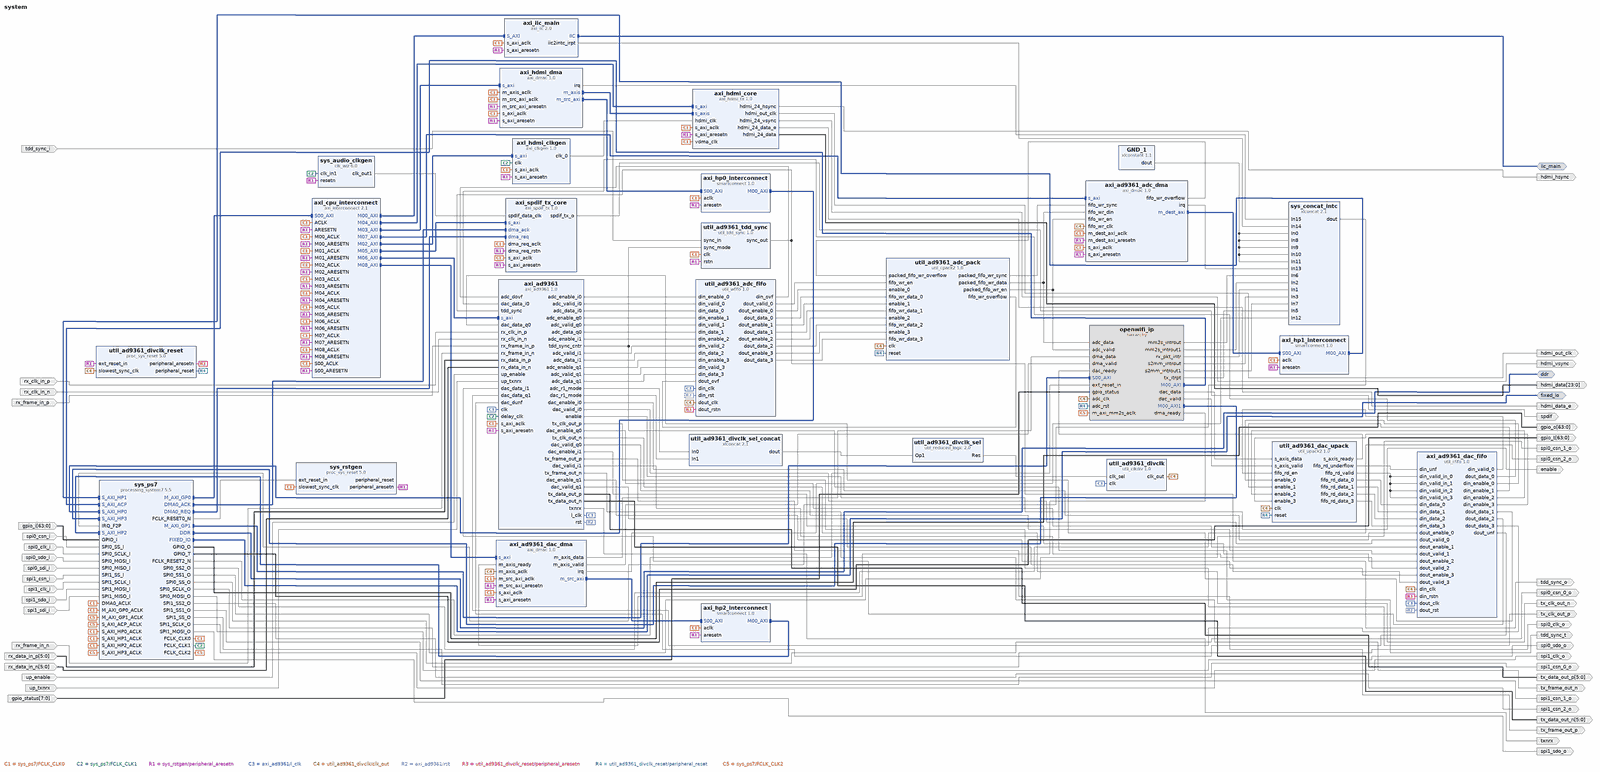
[diagram p0: block diagram of the top level, whole]
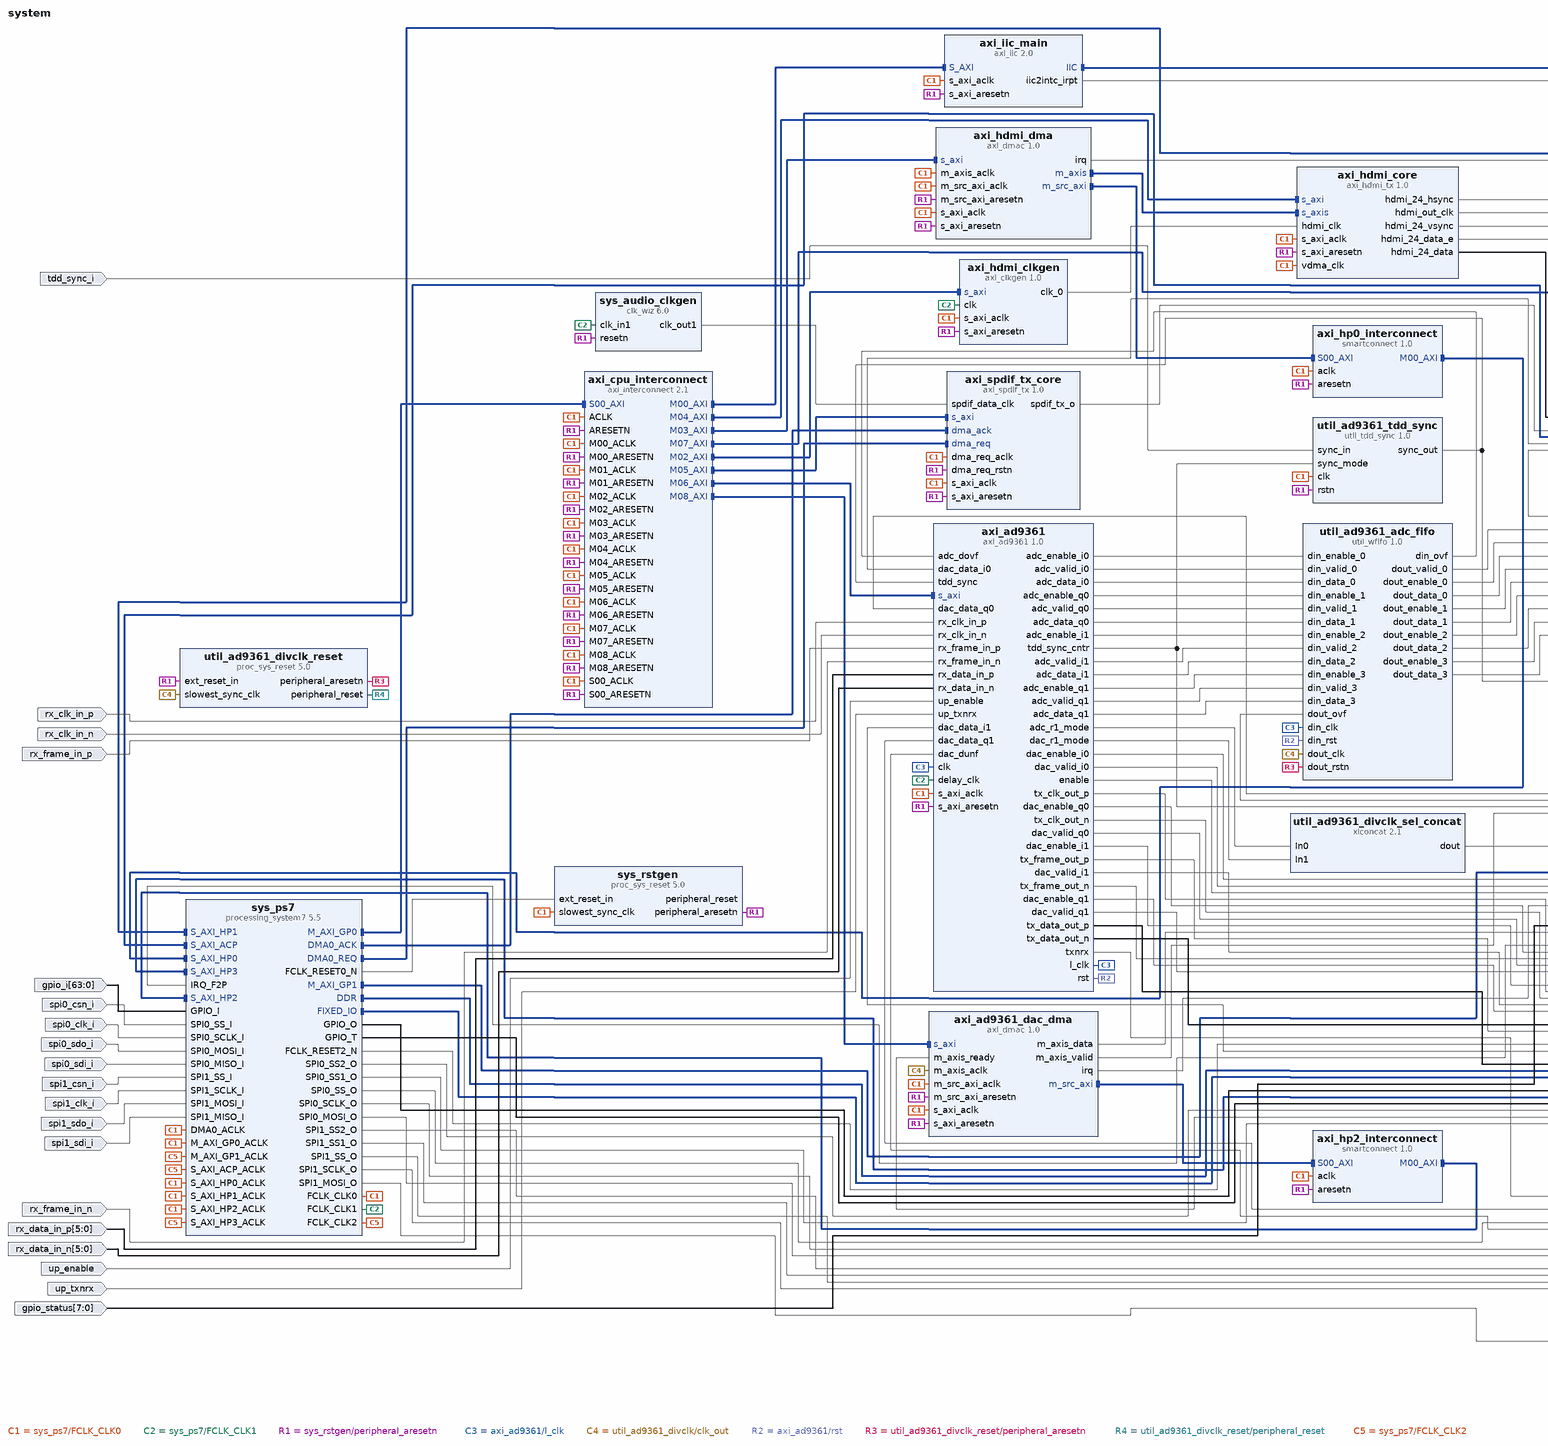
[diagram p1: block diagram of the top level, left part]
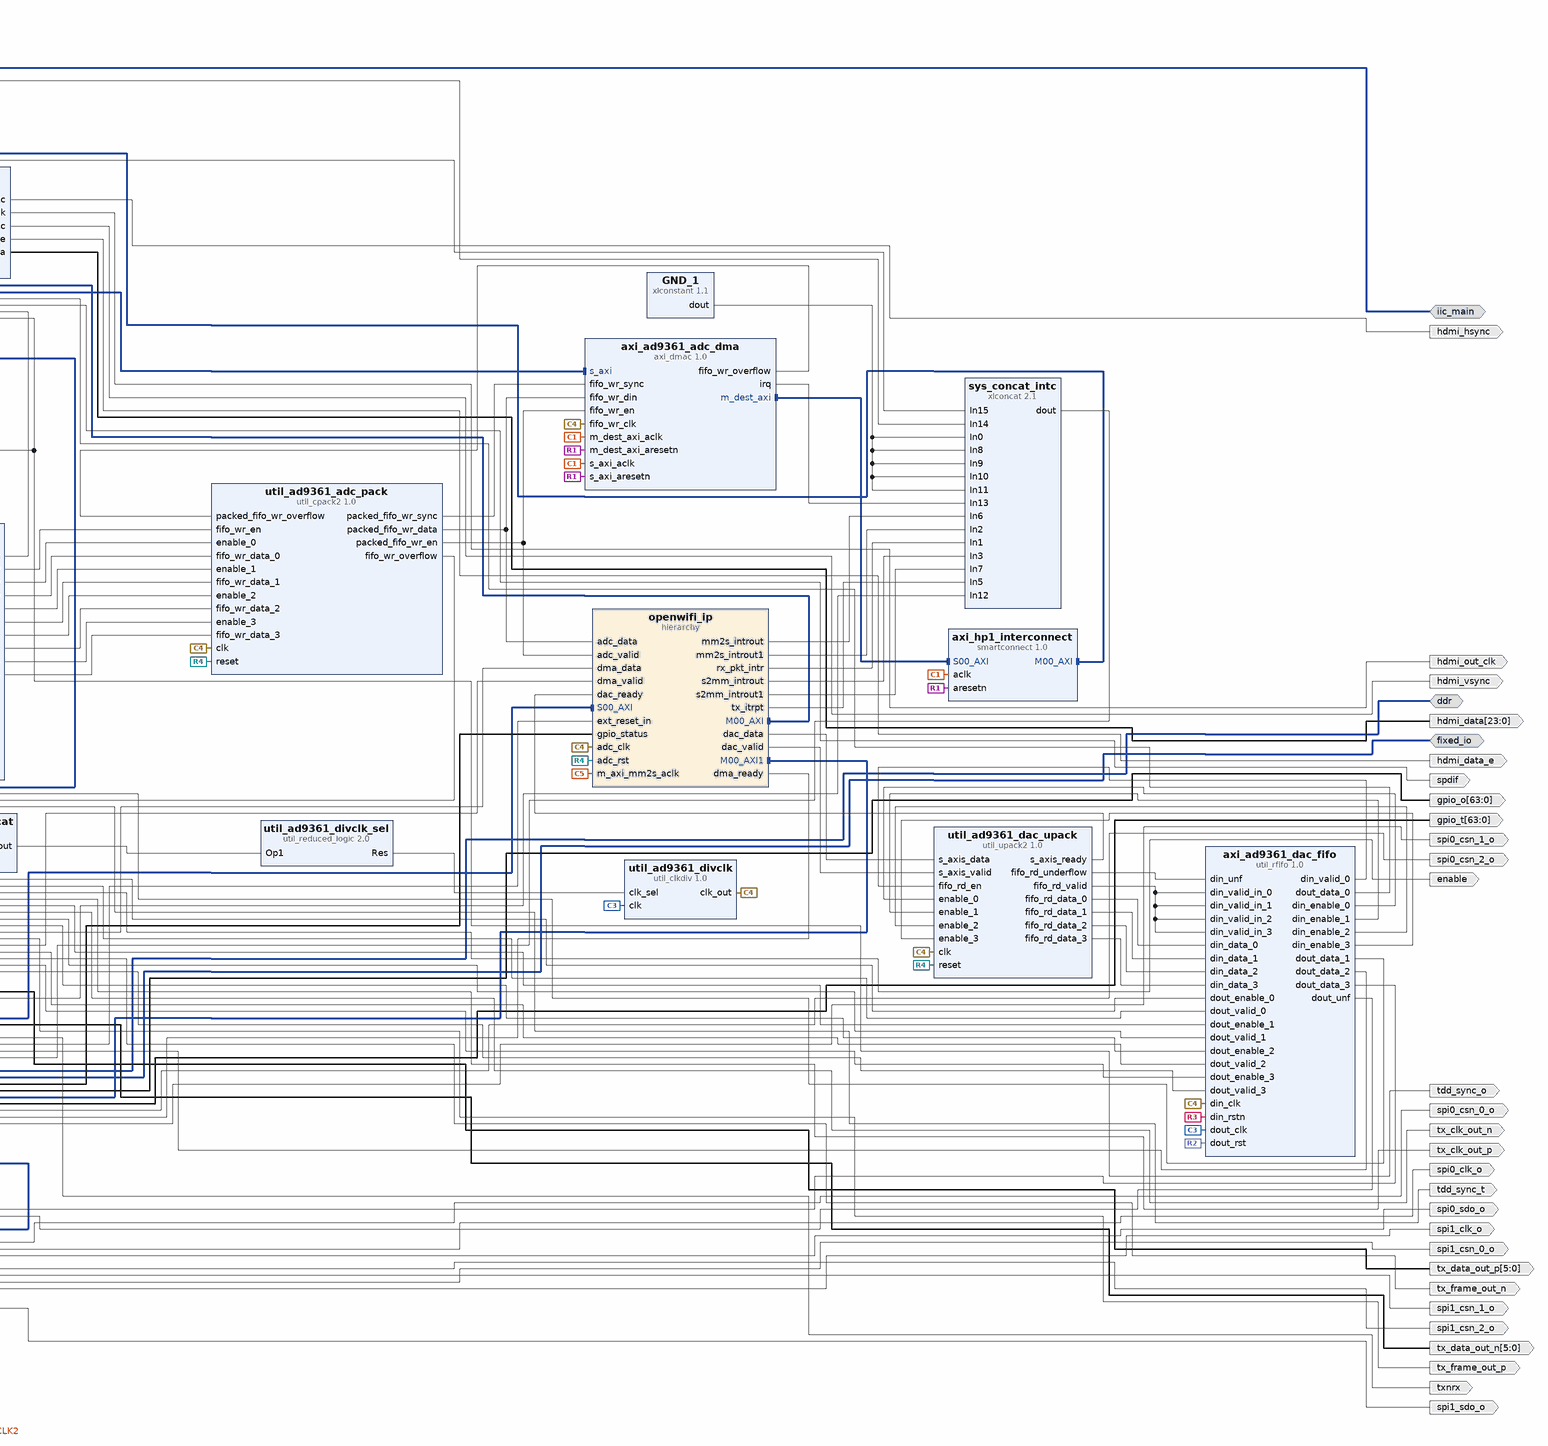
[diagram p2: block diagram of the top level, right part]
# Vivado block design system, xc7z045ffg900-2, Vivado 2018.3
create_bd_design system

create_bd_intf_port -mode Master -vlnv xilinx.com:interface:ddrx_rtl:1.0 ddr
create_bd_intf_port -mode Master -vlnv xilinx.com:interface:iic_rtl:1.0 iic_main
create_bd_intf_port -mode Master -vlnv xilinx.com:display_processing_system7:fixedio_rtl:1.0 fixed_io
create_bd_port -dir O spi0_csn_2_o
create_bd_port -dir O spi0_csn_1_o
create_bd_port -dir O spi0_csn_0_o
create_bd_port -dir I spi0_csn_i
create_bd_port -dir I spi0_clk_i
create_bd_port -dir O spi0_clk_o
create_bd_port -dir I spi0_sdo_i
create_bd_port -dir O spi0_sdo_o
create_bd_port -dir I spi0_sdi_i
create_bd_port -dir O spi1_csn_2_o
create_bd_port -dir O spi1_csn_1_o
create_bd_port -dir O spi1_csn_0_o
create_bd_port -dir I spi1_csn_i
create_bd_port -dir I spi1_clk_i
create_bd_port -dir O spi1_clk_o
create_bd_port -dir I spi1_sdo_i
create_bd_port -dir O spi1_sdo_o
create_bd_port -dir I spi1_sdi_i
create_bd_port -dir I -from 63 -to 0 gpio_i
create_bd_port -dir O -from 63 -to 0 gpio_o
create_bd_port -dir O -from 63 -to 0 gpio_t
create_bd_port -dir O hdmi_out_clk
create_bd_port -dir O hdmi_hsync
create_bd_port -dir O hdmi_vsync
create_bd_port -dir O hdmi_data_e
create_bd_port -dir O -from 23 -to 0 hdmi_data
create_bd_port -dir O spdif
create_bd_port -dir I rx_clk_in_p
create_bd_port -dir I rx_clk_in_n
create_bd_port -dir I rx_frame_in_p
create_bd_port -dir I rx_frame_in_n
create_bd_port -dir I -from 5 -to 0 rx_data_in_p
create_bd_port -dir I -from 5 -to 0 rx_data_in_n
create_bd_port -dir O tx_clk_out_p
create_bd_port -dir O tx_clk_out_n
create_bd_port -dir O tx_frame_out_p
create_bd_port -dir O tx_frame_out_n
create_bd_port -dir O -from 5 -to 0 tx_data_out_p
create_bd_port -dir O -from 5 -to 0 tx_data_out_n
create_bd_port -dir O enable
create_bd_port -dir O txnrx
create_bd_port -dir I up_enable
create_bd_port -dir I up_txnrx
create_bd_port -dir O tdd_sync_o
create_bd_port -dir I tdd_sync_i
create_bd_port -dir O tdd_sync_t
create_bd_port -dir I -from 7 -to 0 gpio_status

create_bd_cell -type ip -vlnv xilinx.com:ip:processing_system7:5.5 sys_ps7
set_property -dict [list \
  CONFIG.PCW_APU_PERIPHERAL_FREQMHZ 667.000000 \
  CONFIG.PCW_DUAL_PARALLEL_QSPI_DATA_MODE x8 \
  CONFIG.PCW_ENET0_ENET0_IO {MIO 16 .. 27} \
  CONFIG.PCW_ENET0_GRP_MDIO_ENABLE 1 \
  CONFIG.PCW_ENET0_GRP_MDIO_IO {MIO 52 .. 53} \
  CONFIG.PCW_ENET0_PERIPHERAL_ENABLE 1 \
  CONFIG.PCW_ENET0_PERIPHERAL_FREQMHZ {100 Mbps} \
  CONFIG.PCW_ENET0_RESET_ENABLE 1 \
  CONFIG.PCW_ENET0_RESET_IO {MIO 47} \
  CONFIG.PCW_ENET_RESET_ENABLE 1 \
  CONFIG.PCW_ENET_RESET_SELECT {Share reset pin} \
  CONFIG.PCW_EN_CLK1_PORT 1 \
  CONFIG.PCW_EN_CLK2_PORT 1 \
  CONFIG.PCW_EN_RST1_PORT 1 \
  CONFIG.PCW_EN_RST2_PORT 1 \
  CONFIG.PCW_FCLK_CLK1_BUF TRUE \
  CONFIG.PCW_FCLK_CLK2_BUF TRUE \
  CONFIG.PCW_FPGA0_PERIPHERAL_FREQMHZ 100.0 \
  CONFIG.PCW_FPGA1_PERIPHERAL_FREQMHZ 200.0 \
  CONFIG.PCW_FPGA2_PERIPHERAL_FREQMHZ 200 \
  CONFIG.PCW_FPGA_FCLK1_ENABLE 1 \
  CONFIG.PCW_FPGA_FCLK2_ENABLE 1 \
  CONFIG.PCW_GPIO_EMIO_GPIO_ENABLE 1 \
  CONFIG.PCW_GPIO_EMIO_GPIO_IO 64 \
  CONFIG.PCW_GPIO_MIO_GPIO_ENABLE 1 \
  CONFIG.PCW_GPIO_MIO_GPIO_IO MIO \
  CONFIG.PCW_I2C0_GRP_INT_ENABLE 0 \
  CONFIG.PCW_I2C0_I2C0_IO {MIO 50 .. 51} \
  CONFIG.PCW_I2C0_PERIPHERAL_ENABLE 1 \
  CONFIG.PCW_I2C0_RESET_ENABLE 1 \
  CONFIG.PCW_I2C0_RESET_IO {MIO 46} \
  CONFIG.PCW_I2C_PERIPHERAL_FREQMHZ 111.111115 \
  CONFIG.PCW_I2C_RESET_ENABLE 1 \
  CONFIG.PCW_I2C_RESET_SELECT {Share reset pin} \
  CONFIG.PCW_IRQ_F2P_INTR 1 \
  CONFIG.PCW_IRQ_F2P_MODE REVERSE \
  CONFIG.PCW_PRESET_BANK0_VOLTAGE {LVCMOS 1.8V} \
  CONFIG.PCW_PRESET_BANK1_VOLTAGE {LVCMOS 1.8V} \
  CONFIG.PCW_QSPI_GRP_FBCLK_ENABLE 1 \
  CONFIG.PCW_QSPI_GRP_FBCLK_IO {MIO 8} \
  CONFIG.PCW_QSPI_GRP_IO1_ENABLE 1 \
  CONFIG.PCW_QSPI_GRP_IO1_IO {MIO 0 9 .. 13} \
  CONFIG.PCW_QSPI_GRP_SINGLE_SS_ENABLE 0 \
  CONFIG.PCW_QSPI_INTERNAL_HIGHADDRESS 0xFDFFFFFF \
  CONFIG.PCW_QSPI_PERIPHERAL_ENABLE 1 \
  CONFIG.PCW_QSPI_QSPI_IO {MIO 1 .. 6} \
  CONFIG.PCW_SD0_GRP_CD_ENABLE 1 \
  CONFIG.PCW_SD0_GRP_CD_IO {MIO 14} \
  CONFIG.PCW_SD0_GRP_WP_ENABLE 1 \
  CONFIG.PCW_SD0_GRP_WP_IO {MIO 15} \
  CONFIG.PCW_SD0_PERIPHERAL_ENABLE 1 \
  CONFIG.PCW_SD0_SD0_IO {MIO 40 .. 45} \
  CONFIG.PCW_SDIO_PERIPHERAL_FREQMHZ 50 \
  CONFIG.PCW_SPI0_PERIPHERAL_ENABLE 1 \
  CONFIG.PCW_SPI0_SPI0_IO EMIO \
  CONFIG.PCW_SPI1_PERIPHERAL_ENABLE 1 \
  CONFIG.PCW_SPI1_SPI1_IO EMIO \
  CONFIG.PCW_UART1_PERIPHERAL_ENABLE 1 \
  CONFIG.PCW_UART1_UART1_IO {MIO 48 .. 49} \
  CONFIG.PCW_UART_PERIPHERAL_FREQMHZ 50 \
  CONFIG.PCW_UIPARAM_DDR_FREQ_MHZ 533.333313 \
  CONFIG.PCW_UIPARAM_DDR_PARTNO Custom \
  CONFIG.PCW_USB0_PERIPHERAL_ENABLE 1 \
  CONFIG.PCW_USB0_RESET_ENABLE 1 \
  CONFIG.PCW_USB0_RESET_IO {MIO 7} \
  CONFIG.PCW_USB0_USB0_IO {MIO 28 .. 39} \
  CONFIG.PCW_USB_RESET_ENABLE 1 \
  CONFIG.PCW_USB_RESET_SELECT {Share reset pin} \
  CONFIG.PCW_USE_DEFAULT_ACP_USER_VAL 1 \
  CONFIG.PCW_USE_DMA0 1 \
  CONFIG.PCW_USE_FABRIC_INTERRUPT 1 \
  CONFIG.PCW_USE_M_AXI_GP1 1 \
  CONFIG.PCW_USE_S_AXI_ACP 1 \
  CONFIG.PCW_USE_S_AXI_HP0 1 \
  CONFIG.PCW_USE_S_AXI_HP1 1 \
  CONFIG.PCW_USE_S_AXI_HP2 1 \
  CONFIG.PCW_USE_S_AXI_HP3 1 \
  CONFIG.preset ZC706 \
] [get_bd_cells sys_ps7]
# 242 more settings of sys_ps7 are not shown: defaults, MIO pin electricals, DDR timing, and values the tool derives
create_bd_cell -type ip -vlnv xilinx.com:ip:axi_iic:2.0 axi_iic_main
set_property -dict {CONFIG.IIC_BOARD_INTERFACE Custom CONFIG.USE_BOARD_FLOW true} [get_bd_cells axi_iic_main]
create_bd_cell -type ip -vlnv xilinx.com:ip:xlconcat:2.1 sys_concat_intc
set_property -dict {CONFIG.NUM_PORTS 16} [get_bd_cells sys_concat_intc]
create_bd_cell -type ip -vlnv xilinx.com:ip:proc_sys_reset:5.0 sys_rstgen
set_property -dict {CONFIG.C_EXT_RST_WIDTH 1} [get_bd_cells sys_rstgen]
create_bd_cell -type ip -vlnv analog.com:user:axi_clkgen:1.0 axi_hdmi_clkgen
create_bd_cell -type ip -vlnv analog.com:user:axi_hdmi_tx:1.0 axi_hdmi_core
set_property -dict {CONFIG.INTERFACE 24_BIT} [get_bd_cells axi_hdmi_core]
create_bd_cell -type ip -vlnv analog.com:user:axi_dmac:1.0 axi_hdmi_dma
set_property -dict [list \
  CONFIG.AXI_SLICE_DEST false \
  CONFIG.AXI_SLICE_SRC false \
  CONFIG.CYCLIC true \
  CONFIG.DMA_2D_TRANSFER true \
  CONFIG.DMA_DATA_WIDTH_SRC 64 \
  CONFIG.DMA_TYPE_DEST 1 \
  CONFIG.DMA_TYPE_SRC 0 \
] [get_bd_cells axi_hdmi_dma]
create_bd_cell -type ip -vlnv xilinx.com:ip:clk_wiz:6.0 sys_audio_clkgen
set_property -dict [list \
  CONFIG.CLKOUT1_REQUESTED_OUT_FREQ 12.288 \
  CONFIG.PRIM_SOURCE No_buffer \
  CONFIG.RESET_TYPE ACTIVE_LOW \
  CONFIG.USE_LOCKED false \
  CONFIG.USE_PHASE_ALIGNMENT false \
  CONFIG.USE_RESET true \
] [get_bd_cells sys_audio_clkgen]
create_bd_cell -type ip -vlnv analog.com:user:axi_spdif_tx:1.0 axi_spdif_tx_core
set_property -dict {CONFIG.DMA_TYPE 1 CONFIG.S_AXI_ADDRESS_WIDTH 16} [get_bd_cells axi_spdif_tx_core]
create_bd_cell -type ip -vlnv xilinx.com:ip:xlconstant:1.1 GND_1
set_property -dict {CONFIG.CONST_VAL 0 CONFIG.CONST_WIDTH 1} [get_bd_cells GND_1]
create_bd_cell -type ip -vlnv xilinx.com:ip:axi_interconnect:2.1 axi_cpu_interconnect
set_property -dict {CONFIG.NUM_MI 9} [get_bd_cells axi_cpu_interconnect]
create_bd_cell -type ip -vlnv xilinx.com:ip:smartconnect:1.0 axi_hp0_interconnect
set_property -dict {CONFIG.NUM_MI 1 CONFIG.NUM_SI 1} [get_bd_cells axi_hp0_interconnect]
create_bd_cell -type ip -vlnv analog.com:user:axi_ad9361:1.0 axi_ad9361
set_property -dict [list \
  CONFIG.ADC_INIT_DELAY 20 \
  CONFIG.DAC_DDS_CORDIC_DW 14 \
  CONFIG.DAC_DDS_TYPE 1 \
  CONFIG.ID 0 \
] [get_bd_cells axi_ad9361]
create_bd_cell -type ip -vlnv analog.com:user:util_tdd_sync:1.0 util_ad9361_tdd_sync
set_property -dict {CONFIG.TDD_SYNC_PERIOD 10000000} [get_bd_cells util_ad9361_tdd_sync]
create_bd_cell -type ip -vlnv xilinx.com:ip:xlconcat:2.1 util_ad9361_divclk_sel_concat
set_property -dict {CONFIG.NUM_PORTS 2} [get_bd_cells util_ad9361_divclk_sel_concat]
create_bd_cell -type ip -vlnv xilinx.com:ip:util_reduced_logic:2.0 util_ad9361_divclk_sel
set_property -dict {CONFIG.C_SIZE 2} [get_bd_cells util_ad9361_divclk_sel]
create_bd_cell -type ip -vlnv analog.com:user:util_clkdiv:1.0 util_ad9361_divclk
create_bd_cell -type ip -vlnv xilinx.com:ip:proc_sys_reset:5.0 util_ad9361_divclk_reset
create_bd_cell -type ip -vlnv analog.com:user:util_wfifo:1.0 util_ad9361_adc_fifo
set_property -dict [list \
  CONFIG.DIN_ADDRESS_WIDTH 4 \
  CONFIG.DIN_DATA_WIDTH 16 \
  CONFIG.DOUT_DATA_WIDTH 16 \
  CONFIG.NUM_OF_CHANNELS 4 \
] [get_bd_cells util_ad9361_adc_fifo]
create_bd_cell -type ip -vlnv analog.com:user:util_cpack2:1.0 util_ad9361_adc_pack
set_property -dict {CONFIG.NUM_OF_CHANNELS 4 CONFIG.SAMPLE_DATA_WIDTH 16} [get_bd_cells util_ad9361_adc_pack]
create_bd_cell -type ip -vlnv analog.com:user:axi_dmac:1.0 axi_ad9361_adc_dma
set_property -dict [list \
  CONFIG.AXI_SLICE_DEST false \
  CONFIG.AXI_SLICE_SRC false \
  CONFIG.CYCLIC false \
  CONFIG.DMA_2D_TRANSFER false \
  CONFIG.DMA_DATA_WIDTH_SRC 64 \
  CONFIG.DMA_TYPE_DEST 0 \
  CONFIG.DMA_TYPE_SRC 2 \
  CONFIG.SYNC_TRANSFER_START true \
] [get_bd_cells axi_ad9361_adc_dma]
create_bd_cell -type ip -vlnv analog.com:user:util_rfifo:1.0 axi_ad9361_dac_fifo
set_property -dict [list \
  CONFIG.DIN_ADDRESS_WIDTH 4 \
  CONFIG.DIN_DATA_WIDTH 16 \
  CONFIG.DOUT_DATA_WIDTH 16 \
] [get_bd_cells axi_ad9361_dac_fifo]
create_bd_cell -type ip -vlnv analog.com:user:util_upack2:1.0 util_ad9361_dac_upack
set_property -dict {CONFIG.NUM_OF_CHANNELS 4 CONFIG.SAMPLE_DATA_WIDTH 16} [get_bd_cells util_ad9361_dac_upack]
create_bd_cell -type ip -vlnv analog.com:user:axi_dmac:1.0 axi_ad9361_dac_dma
set_property -dict [list \
  CONFIG.AXI_SLICE_DEST false \
  CONFIG.AXI_SLICE_SRC false \
  CONFIG.CYCLIC true \
  CONFIG.DMA_2D_TRANSFER false \
  CONFIG.DMA_DATA_WIDTH_DEST 64 \
  CONFIG.DMA_TYPE_DEST 1 \
  CONFIG.DMA_TYPE_SRC 0 \
] [get_bd_cells axi_ad9361_dac_dma]
create_bd_cell -type ip -vlnv xilinx.com:ip:smartconnect:1.0 axi_hp1_interconnect
set_property -dict {CONFIG.NUM_MI 1 CONFIG.NUM_SI 1} [get_bd_cells axi_hp1_interconnect]
create_bd_cell -type ip -vlnv xilinx.com:ip:smartconnect:1.0 axi_hp2_interconnect
set_property -dict {CONFIG.NUM_MI 1 CONFIG.NUM_SI 1} [get_bd_cells axi_hp2_interconnect]
create_bd_cell -type hier openwifi_ip

# ---- hierarchy /openwifi_ip ----
current_bd_instance /openwifi_ip
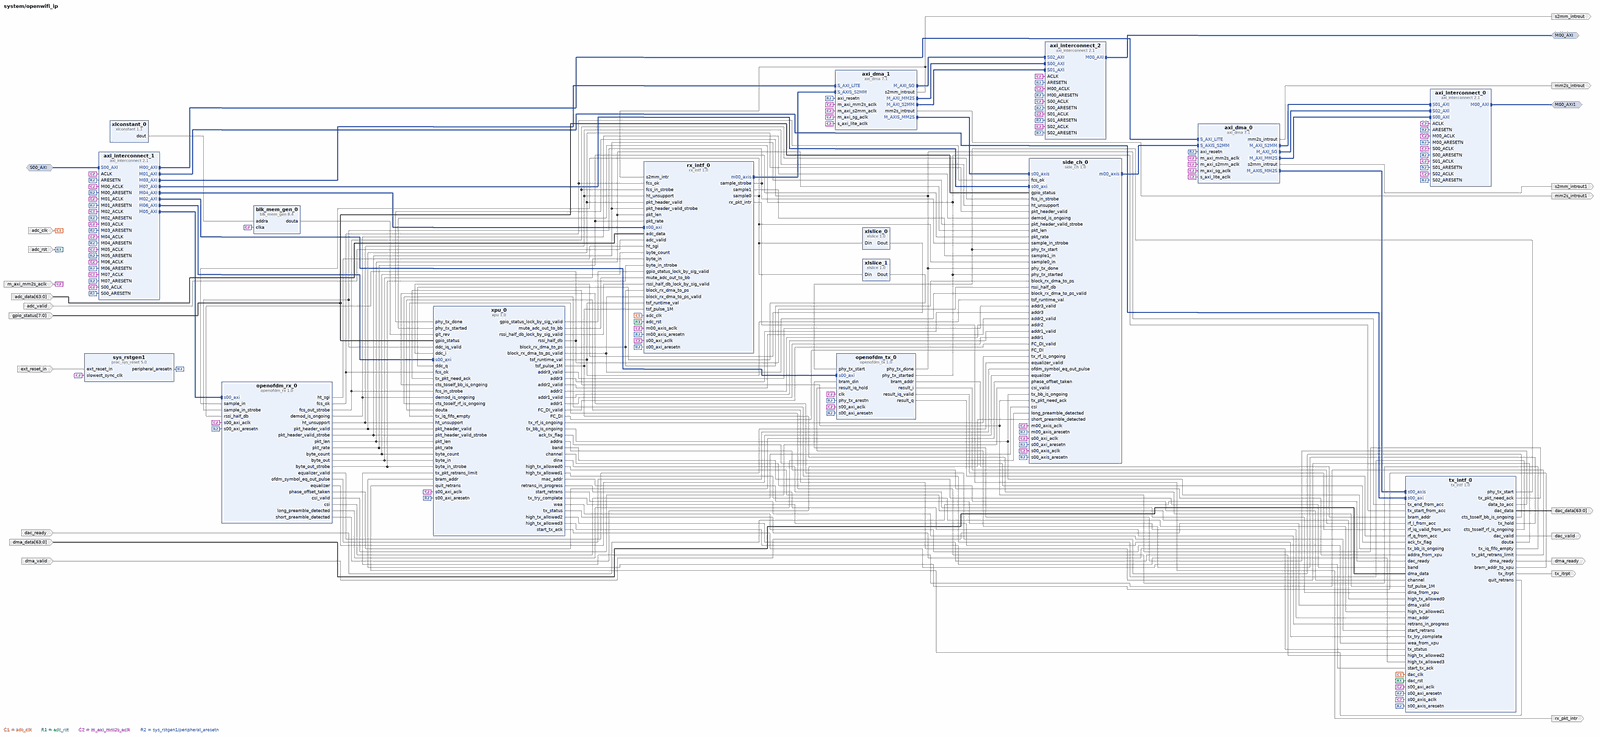
[diagram p3: block diagram inside /openwifi_ip, whole]
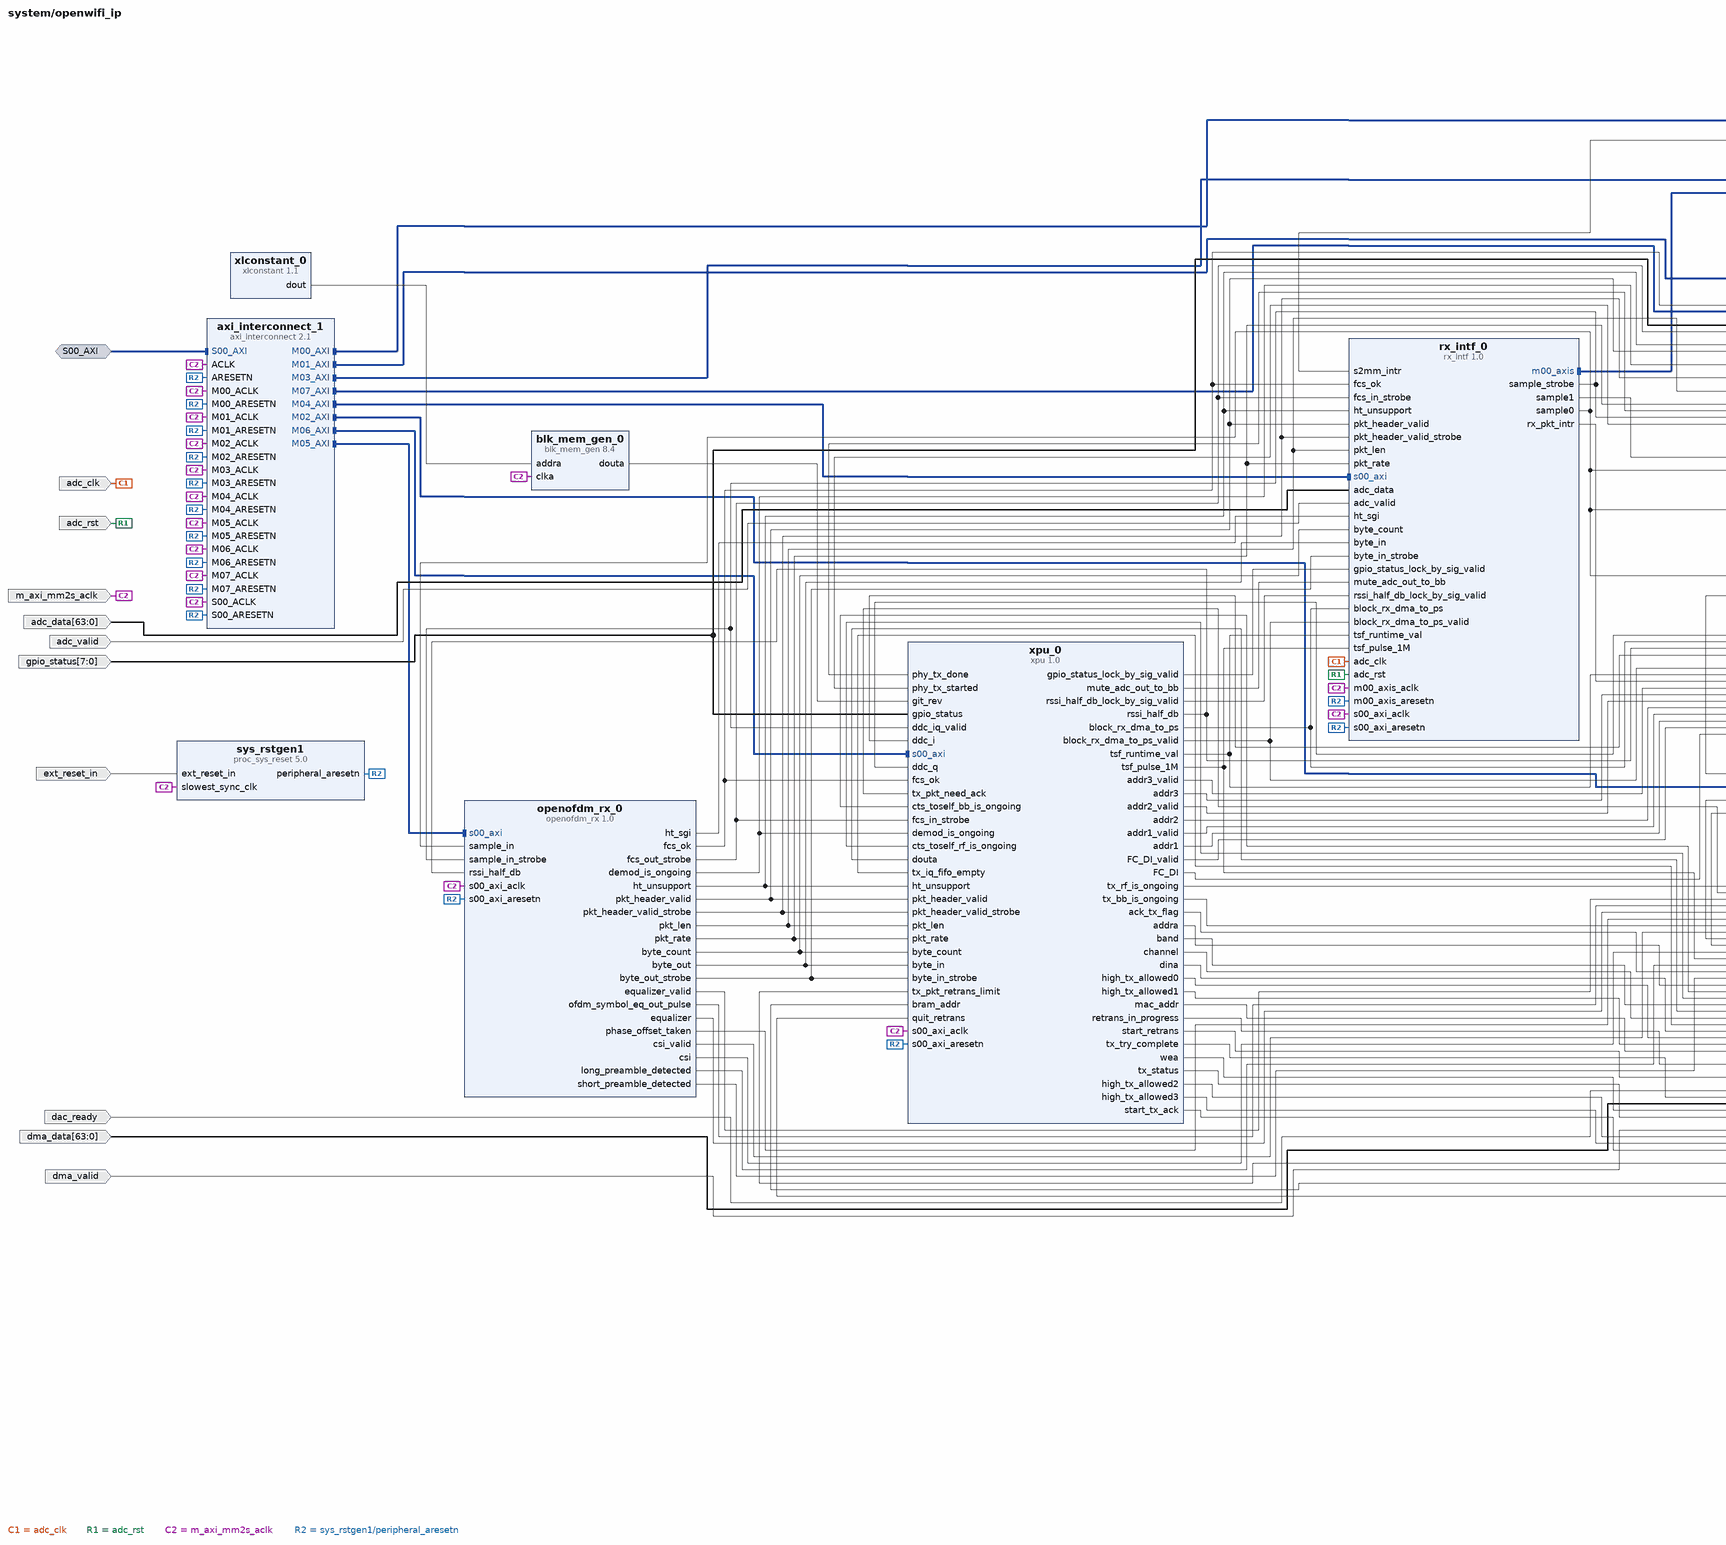
[diagram p4: block diagram inside /openwifi_ip, left part]
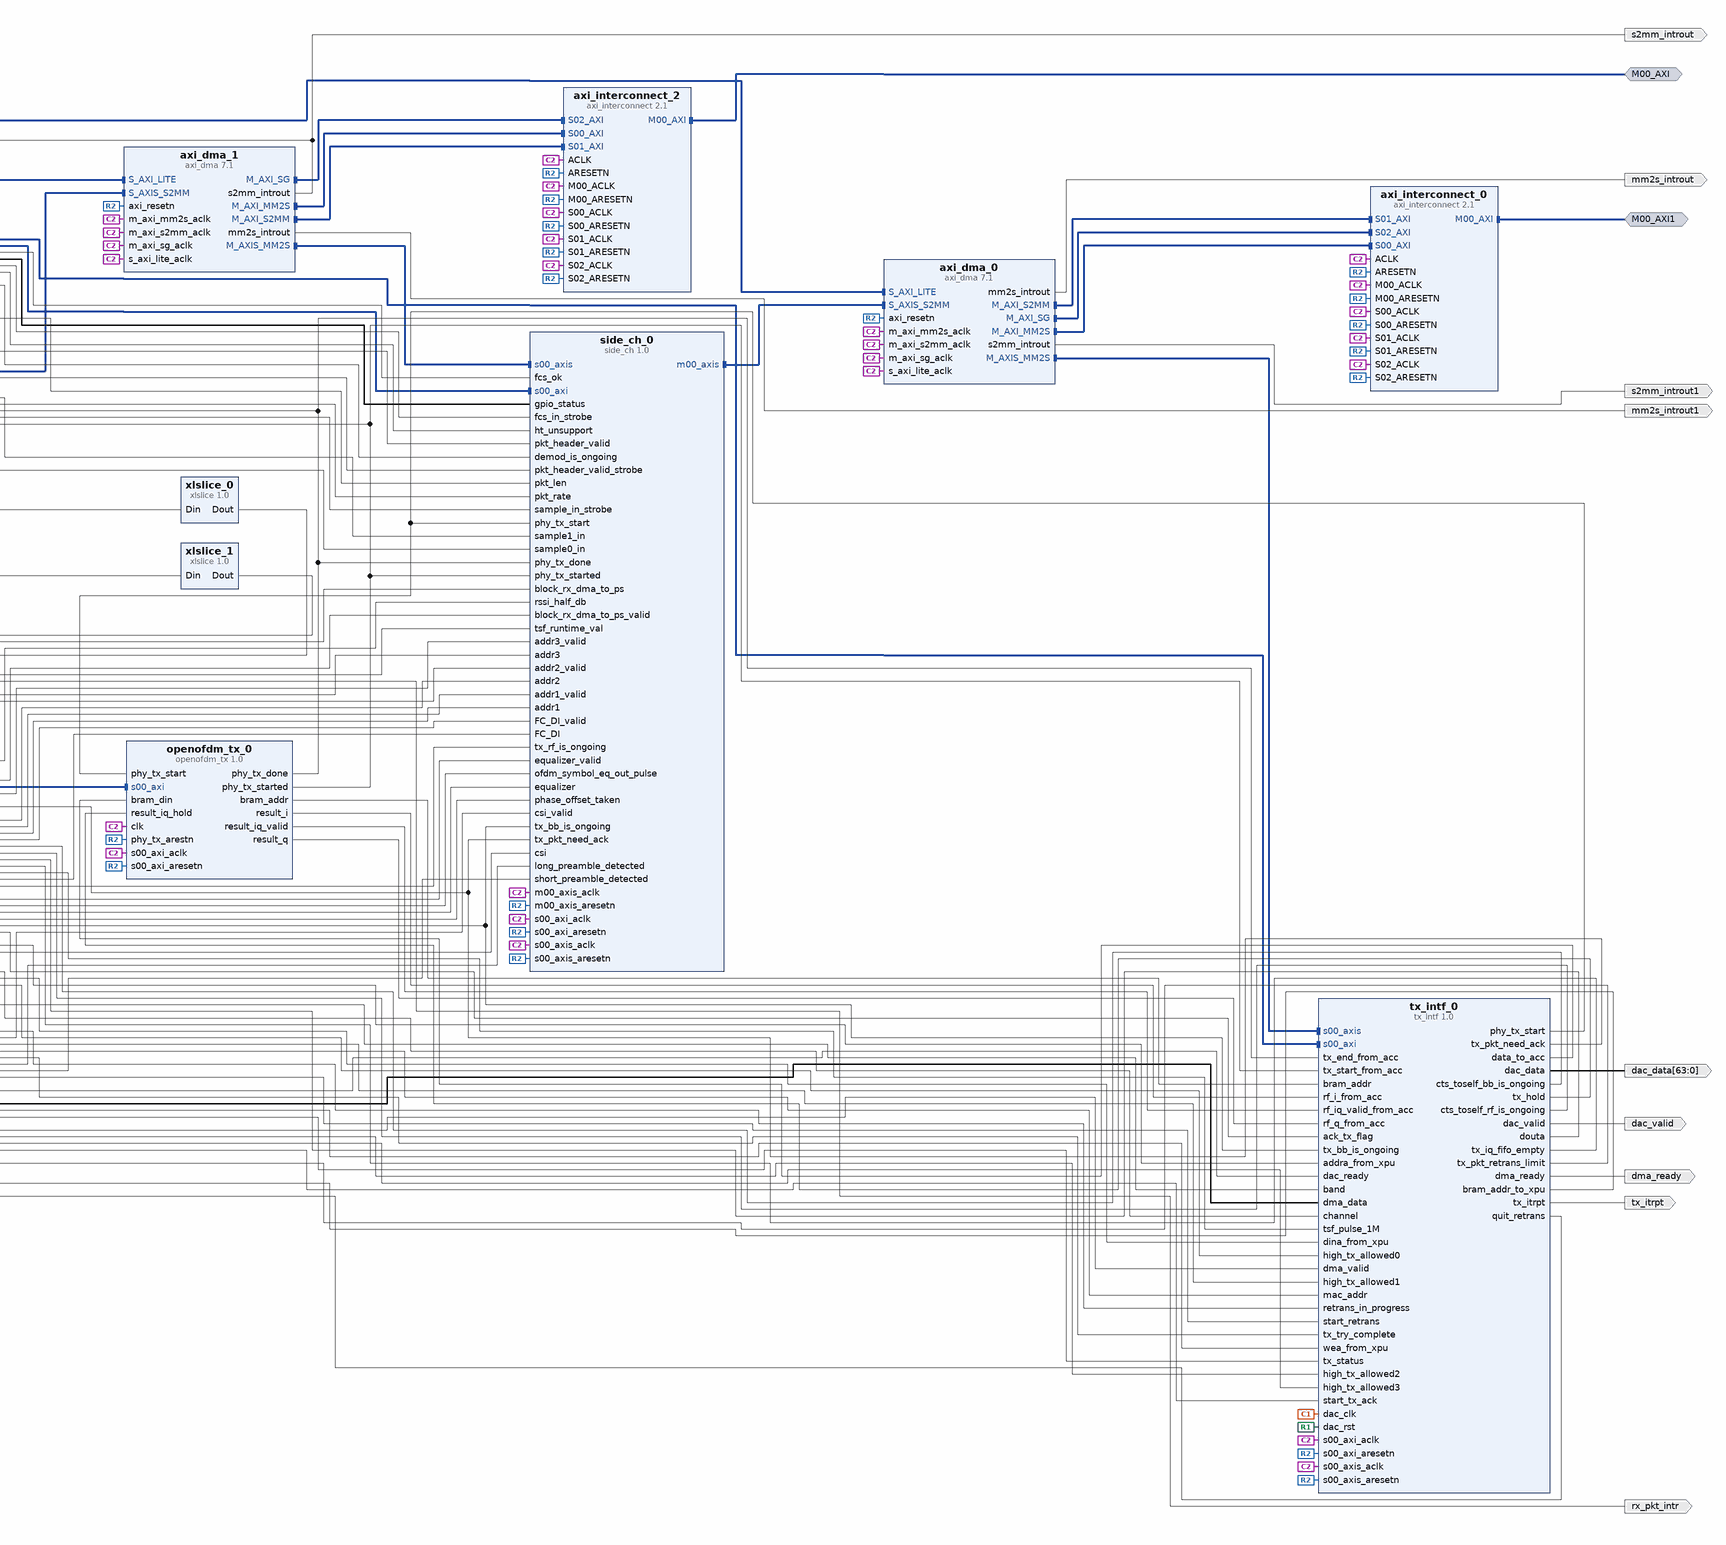
[diagram p5: block diagram inside /openwifi_ip, right part]
create_bd_intf_pin -mode Master -vlnv xilinx.com:interface:aximm_rtl:1.0 M00_AXI
create_bd_intf_pin -mode Master -vlnv xilinx.com:interface:aximm_rtl:1.0 M00_AXI1
create_bd_intf_pin -mode Slave -vlnv xilinx.com:interface:aximm_rtl:1.0 S00_AXI
create_bd_pin -dir I -type clk adc_clk
create_bd_pin -dir I -from 63 -to 0 adc_data
create_bd_pin -dir I -type rst adc_rst
create_bd_pin -dir I adc_valid
create_bd_pin -dir O -from 63 -to 0 dac_data
create_bd_pin -dir I dac_ready
create_bd_pin -dir O dac_valid
create_bd_pin -dir I -from 63 -to 0 dma_data
create_bd_pin -dir O dma_ready
create_bd_pin -dir I dma_valid
create_bd_pin -dir I -type rst ext_reset_in
create_bd_pin -dir I -from 7 -to 0 gpio_status
create_bd_pin -dir I -type clk m_axi_mm2s_aclk
create_bd_pin -dir O -type intr mm2s_introut
create_bd_pin -dir O -type intr mm2s_introut1
create_bd_pin -dir O -type intr rx_pkt_intr
create_bd_pin -dir O -type intr s2mm_introut
create_bd_pin -dir O -type intr s2mm_introut1
create_bd_pin -dir O tx_itrpt

create_bd_cell -type ip -vlnv xilinx.com:ip:axi_dma:7.1 axi_dma_0
set_property -dict [list \
  CONFIG.c_include_mm2s_dre 1 \
  CONFIG.c_include_s2mm_dre 1 \
  CONFIG.c_include_sg 1 \
  CONFIG.c_m_axi_mm2s_data_width 64 \
  CONFIG.c_m_axis_mm2s_tdata_width 64 \
  CONFIG.c_mm2s_burst_size 256 \
  CONFIG.c_s2mm_burst_size 256 \
  CONFIG.c_sg_include_stscntrl_strm 0 \
] [get_bd_cells axi_dma_0]
create_bd_cell -type ip -vlnv xilinx.com:ip:axi_dma:7.1 axi_dma_1
set_property -dict [list \
  CONFIG.c_include_mm2s_dre 1 \
  CONFIG.c_include_s2mm_dre 1 \
  CONFIG.c_include_sg 1 \
  CONFIG.c_m_axi_mm2s_data_width 64 \
  CONFIG.c_m_axis_mm2s_tdata_width 64 \
  CONFIG.c_mm2s_burst_size 256 \
  CONFIG.c_s2mm_burst_size 256 \
  CONFIG.c_sg_include_stscntrl_strm 0 \
] [get_bd_cells axi_dma_1]
create_bd_cell -type ip -vlnv xilinx.com:ip:axi_interconnect:2.1 axi_interconnect_0
set_property -dict {CONFIG.ENABLE_ADVANCED_OPTIONS 0 CONFIG.NUM_MI 1 CONFIG.NUM_SI 3} [get_bd_cells axi_interconnect_0]
create_bd_cell -type ip -vlnv xilinx.com:ip:axi_interconnect:2.1 axi_interconnect_1
set_property -dict {CONFIG.ENABLE_ADVANCED_OPTIONS 1 CONFIG.NUM_MI 8} [get_bd_cells axi_interconnect_1]
create_bd_cell -type ip -vlnv xilinx.com:ip:axi_interconnect:2.1 axi_interconnect_2
set_property -dict {CONFIG.ENABLE_ADVANCED_OPTIONS 0 CONFIG.NUM_MI 1 CONFIG.NUM_SI 3} [get_bd_cells axi_interconnect_2]
create_bd_cell -type ip -vlnv user.org:user:openofdm_tx:1.0 openofdm_tx_0
create_bd_cell -type ip -vlnv xilinx.com:ip:proc_sys_reset:5.0 sys_rstgen1
set_property -dict {CONFIG.C_EXT_RST_WIDTH 1} [get_bd_cells sys_rstgen1]
create_bd_cell -type ip -vlnv xilinx.com:ip:xlslice:1.0 xlslice_0
set_property -dict {CONFIG.DIN_FROM 31 CONFIG.DIN_TO 16 CONFIG.DOUT_WIDTH 16} [get_bd_cells xlslice_0]
create_bd_cell -type ip -vlnv xilinx.com:ip:xlslice:1.0 xlslice_1
set_property -dict {CONFIG.DIN_FROM 15 CONFIG.DIN_TO 0 CONFIG.DOUT_WIDTH 16} [get_bd_cells xlslice_1]
create_bd_cell -type ip -vlnv xilinx.com:ip:blk_mem_gen:8.4 blk_mem_gen_0
set_property -dict [list \
  CONFIG.Coe_File ../../../openwifi_rev.coe \
  CONFIG.Enable_32bit_Address false \
  CONFIG.Enable_A Always_Enabled \
  CONFIG.Load_Init_File true \
  CONFIG.Memory_Type Single_Port_ROM \
  CONFIG.Port_A_Write_Rate 0 \
  CONFIG.Register_PortA_Output_of_Memory_Primitives true \
  CONFIG.Use_RSTA_Pin false \
  CONFIG.Write_Depth_A 4 \
  CONFIG.use_bram_block Stand_Alone \
] [get_bd_cells blk_mem_gen_0]
create_bd_cell -type ip -vlnv xilinx.com:ip:xlconstant:1.1 xlconstant_0
set_property -dict {CONFIG.CONST_VAL 0 CONFIG.CONST_WIDTH 2} [get_bd_cells xlconstant_0]
create_bd_cell -type ip -vlnv user.org:user:openofdm_rx:1.0 openofdm_rx_0
create_bd_cell -type ip -vlnv user.org:user:rx_intf:1.0 rx_intf_0
create_bd_cell -type ip -vlnv user.org:user:xpu:1.0 xpu_0
set_property -dict {CONFIG.C_S00_AXI_ADDR_WIDTH 8} [get_bd_cells xpu_0]
create_bd_cell -type ip -vlnv user.org:user:side_ch:1.0 side_ch_0
create_bd_cell -type ip -vlnv user.org:user:tx_intf:1.0 tx_intf_0

# ---- connections ----

current_bd_instance /openwifi_ip
connect_bd_intf_net [get_bd_intf_pins axi_interconnect_1/M04_AXI] [get_bd_intf_pins rx_intf_0/s00_axi]
connect_bd_intf_net -intf_net openwifi_ip_M00_AXI1 [get_bd_intf_pins M00_AXI1] [get_bd_intf_pins axi_interconnect_0/M00_AXI]
connect_bd_intf_net -intf_net openwifi_ip_M00_AXI [get_bd_intf_pins M00_AXI] [get_bd_intf_pins axi_interconnect_2/M00_AXI]
connect_bd_intf_net [get_bd_intf_pins axi_dma_0/S_AXI_LITE] [get_bd_intf_pins axi_interconnect_1/M00_AXI]
connect_bd_intf_net [get_bd_intf_pins axi_interconnect_1/M01_AXI] [get_bd_intf_pins tx_intf_0/s00_axi]
connect_bd_intf_net [get_bd_intf_pins axi_dma_0/M_AXI_S2MM] [get_bd_intf_pins axi_interconnect_0/S01_AXI]
connect_bd_intf_net [get_bd_intf_pins axi_dma_0/S_AXIS_S2MM] [get_bd_intf_pins side_ch_0/m00_axis]
connect_bd_intf_net [get_bd_intf_pins axi_dma_1/S_AXI_LITE] [get_bd_intf_pins axi_interconnect_1/M03_AXI]
connect_bd_intf_net [get_bd_intf_pins axi_dma_1/M_AXI_SG] [get_bd_intf_pins axi_interconnect_2/S02_AXI]
connect_bd_intf_net [get_bd_intf_pins axi_dma_0/M_AXI_SG] [get_bd_intf_pins axi_interconnect_0/S02_AXI]
connect_bd_intf_net [get_bd_intf_pins axi_dma_0/M_AXI_MM2S] [get_bd_intf_pins axi_interconnect_0/S00_AXI]
connect_bd_intf_net [get_bd_intf_pins axi_interconnect_1/M06_AXI] [get_bd_intf_pins xpu_0/s00_axi]
connect_bd_intf_net [get_bd_intf_pins axi_dma_1/M_AXI_MM2S] [get_bd_intf_pins axi_interconnect_2/S00_AXI]
connect_bd_intf_net -intf_net sys_ps7_M_AXI_GP1 [get_bd_intf_pins S00_AXI] [get_bd_intf_pins axi_interconnect_1/S00_AXI]
connect_bd_intf_net [get_bd_intf_pins side_ch_0/s00_axi] [get_bd_intf_pins axi_interconnect_1/M07_AXI]
connect_bd_intf_net [get_bd_intf_pins axi_interconnect_1/M02_AXI] [get_bd_intf_pins openofdm_tx_0/s00_axi]
connect_bd_intf_net [get_bd_intf_pins axi_dma_1/S_AXIS_S2MM] [get_bd_intf_pins rx_intf_0/m00_axis]
connect_bd_intf_net [get_bd_intf_pins axi_dma_1/M_AXI_S2MM] [get_bd_intf_pins axi_interconnect_2/S01_AXI]
connect_bd_intf_net [get_bd_intf_pins side_ch_0/s00_axis] [get_bd_intf_pins axi_dma_1/M_AXIS_MM2S]
connect_bd_intf_net [get_bd_intf_pins axi_interconnect_1/M05_AXI] [get_bd_intf_pins openofdm_rx_0/s00_axi]
connect_bd_intf_net [get_bd_intf_pins axi_dma_0/M_AXIS_MM2S] [get_bd_intf_pins tx_intf_0/s00_axis]
connect_bd_net [get_bd_pins adc_clk] [get_bd_pins rx_intf_0/adc_clk] [get_bd_pins tx_intf_0/dac_clk]
connect_bd_net [get_bd_pins adc_data] [get_bd_pins rx_intf_0/adc_data]
connect_bd_net [get_bd_pins adc_rst] [get_bd_pins rx_intf_0/adc_rst] [get_bd_pins tx_intf_0/dac_rst]
connect_bd_net [get_bd_pins adc_valid] [get_bd_pins rx_intf_0/adc_valid]
connect_bd_net [get_bd_pins dac_ready] [get_bd_pins tx_intf_0/dac_ready]
connect_bd_net [get_bd_pins dma_data] [get_bd_pins tx_intf_0/dma_data]
connect_bd_net [get_bd_pins dma_valid] [get_bd_pins tx_intf_0/dma_valid]
connect_bd_net [get_bd_pins gpio_status] [get_bd_pins xpu_0/gpio_status] [get_bd_pins side_ch_0/gpio_status]
connect_bd_net [get_bd_pins openofdm_rx_0/byte_count] [get_bd_pins rx_intf_0/byte_count] [get_bd_pins xpu_0/byte_count]
connect_bd_net [get_bd_pins openofdm_rx_0/byte_out] [get_bd_pins rx_intf_0/byte_in] [get_bd_pins xpu_0/byte_in]
connect_bd_net [get_bd_pins openofdm_rx_0/byte_out_strobe] [get_bd_pins rx_intf_0/byte_in_strobe] [get_bd_pins xpu_0/byte_in_strobe]
connect_bd_net [get_bd_pins openofdm_rx_0/demod_is_ongoing] [get_bd_pins xpu_0/demod_is_ongoing] [get_bd_pins side_ch_0/demod_is_ongoing]
connect_bd_net [get_bd_pins openofdm_rx_0/fcs_ok] [get_bd_pins rx_intf_0/fcs_ok] [get_bd_pins xpu_0/fcs_ok] [get_bd_pins side_ch_0/fcs_ok]
connect_bd_net [get_bd_pins openofdm_rx_0/fcs_out_strobe] \
  [get_bd_pins rx_intf_0/fcs_in_strobe] [get_bd_pins xpu_0/fcs_in_strobe] [get_bd_pins side_ch_0/fcs_in_strobe]
connect_bd_net [get_bd_pins openofdm_rx_0/ht_unsupport] \
  [get_bd_pins rx_intf_0/ht_unsupport] [get_bd_pins xpu_0/ht_unsupport] [get_bd_pins side_ch_0/ht_unsupport]
connect_bd_net [get_bd_pins openofdm_rx_0/pkt_header_valid] \
  [get_bd_pins rx_intf_0/pkt_header_valid] [get_bd_pins xpu_0/pkt_header_valid] [get_bd_pins side_ch_0/pkt_header_valid]
connect_bd_net [get_bd_pins openofdm_rx_0/pkt_header_valid_strobe] \
  [get_bd_pins rx_intf_0/pkt_header_valid_strobe] [get_bd_pins xpu_0/pkt_header_valid_strobe] \
  [get_bd_pins side_ch_0/pkt_header_valid_strobe]
connect_bd_net [get_bd_pins openofdm_rx_0/pkt_len] [get_bd_pins rx_intf_0/pkt_len] [get_bd_pins xpu_0/pkt_len] [get_bd_pins side_ch_0/pkt_len]
connect_bd_net [get_bd_pins openofdm_rx_0/pkt_rate] [get_bd_pins rx_intf_0/pkt_rate] [get_bd_pins xpu_0/pkt_rate] [get_bd_pins side_ch_0/pkt_rate]
connect_bd_net [get_bd_pins openofdm_tx_0/bram_addr] [get_bd_pins tx_intf_0/bram_addr]
connect_bd_net [get_bd_pins openofdm_tx_0/result_i] [get_bd_pins tx_intf_0/rf_i_from_acc]
connect_bd_net [get_bd_pins openofdm_tx_0/result_iq_valid] [get_bd_pins tx_intf_0/rf_iq_valid_from_acc]
connect_bd_net [get_bd_pins openofdm_tx_0/result_q] [get_bd_pins tx_intf_0/rf_q_from_acc]
connect_bd_net -net openwifi_ip_mm2s_introut [get_bd_pins axi_dma_0/mm2s_introut] [get_bd_pins mm2s_introut]
connect_bd_net -net openwifi_ip_mm2s_introut1 [get_bd_pins axi_dma_1/mm2s_introut] [get_bd_pins mm2s_introut1]
connect_bd_net -net openwifi_ip_rx_pkt_intr [get_bd_pins rx_intf_0/rx_pkt_intr] [get_bd_pins rx_pkt_intr]
connect_bd_net -net openwifi_ip_s2mm_introut [get_bd_pins axi_dma_1/s2mm_introut] [get_bd_pins s2mm_introut] [get_bd_pins rx_intf_0/s2mm_intr]
connect_bd_net -net openwifi_ip_s2mm_introut1 [get_bd_pins axi_dma_0/s2mm_introut] [get_bd_pins s2mm_introut1]
connect_bd_net -net phy_tx_0_phy_tx_done [get_bd_pins openofdm_tx_0/phy_tx_done] \
  [get_bd_pins xpu_0/phy_tx_done] [get_bd_pins tx_intf_0/tx_end_from_acc] [get_bd_pins side_ch_0/phy_tx_done]
connect_bd_net -net phy_tx_0_phy_tx_started [get_bd_pins openofdm_tx_0/phy_tx_started] \
  [get_bd_pins xpu_0/phy_tx_started] [get_bd_pins tx_intf_0/tx_start_from_acc] [get_bd_pins side_ch_0/phy_tx_started]
connect_bd_net [get_bd_pins rx_intf_0/sample0] \
  [get_bd_pins xlslice_0/Din] [get_bd_pins xlslice_1/Din] [get_bd_pins openofdm_rx_0/sample_in] \
  [get_bd_pins side_ch_0/sample0_in]
connect_bd_net [get_bd_pins rx_intf_0/sample_strobe] \
  [get_bd_pins openofdm_rx_0/sample_in_strobe] [get_bd_pins xpu_0/ddc_iq_valid] [get_bd_pins side_ch_0/sample_in_strobe]
connect_bd_net -net s_axi_lite_aclk_1 [get_bd_pins m_axi_mm2s_aclk] \
  [get_bd_pins axi_dma_0/m_axi_mm2s_aclk] [get_bd_pins axi_dma_0/m_axi_s2mm_aclk] [get_bd_pins axi_dma_0/m_axi_sg_aclk] \
  [get_bd_pins axi_dma_0/s_axi_lite_aclk] [get_bd_pins axi_dma_1/m_axi_mm2s_aclk] [get_bd_pins axi_dma_1/m_axi_s2mm_aclk] \
  [get_bd_pins axi_dma_1/m_axi_sg_aclk] [get_bd_pins axi_dma_1/s_axi_lite_aclk] [get_bd_pins axi_interconnect_0/ACLK] \
  [get_bd_pins axi_interconnect_0/M00_ACLK] [get_bd_pins axi_interconnect_0/S00_ACLK] \
  [get_bd_pins axi_interconnect_0/S01_ACLK] [get_bd_pins axi_interconnect_0/S02_ACLK] [get_bd_pins axi_interconnect_1/ACLK] \
  [get_bd_pins axi_interconnect_1/M00_ACLK] [get_bd_pins axi_interconnect_1/M01_ACLK] \
  [get_bd_pins axi_interconnect_1/M02_ACLK] [get_bd_pins axi_interconnect_1/M03_ACLK] \
  [get_bd_pins axi_interconnect_1/M04_ACLK] [get_bd_pins axi_interconnect_1/M05_ACLK] \
  [get_bd_pins axi_interconnect_1/M06_ACLK] [get_bd_pins axi_interconnect_1/S00_ACLK] [get_bd_pins axi_interconnect_2/ACLK] \
  [get_bd_pins axi_interconnect_2/M00_ACLK] [get_bd_pins axi_interconnect_2/S00_ACLK] \
  [get_bd_pins axi_interconnect_2/S01_ACLK] [get_bd_pins axi_interconnect_2/S02_ACLK] [get_bd_pins openofdm_tx_0/clk] \
  [get_bd_pins openofdm_tx_0/s00_axi_aclk] [get_bd_pins sys_rstgen1/slowest_sync_clk] [get_bd_pins blk_mem_gen_0/clka] \
  [get_bd_pins openofdm_rx_0/s00_axi_aclk] [get_bd_pins rx_intf_0/s00_axi_aclk] [get_bd_pins rx_intf_0/m00_axis_aclk] \
  [get_bd_pins xpu_0/s00_axi_aclk] [get_bd_pins side_ch_0/s00_axi_aclk] [get_bd_pins side_ch_0/s00_axis_aclk] \
  [get_bd_pins side_ch_0/m00_axis_aclk] [get_bd_pins tx_intf_0/s00_axi_aclk] [get_bd_pins tx_intf_0/s00_axis_aclk] \
  [get_bd_pins axi_interconnect_1/M07_ACLK]
connect_bd_net -net sys_ps7_FCLK_RESET2_N [get_bd_pins ext_reset_in] [get_bd_pins sys_rstgen1/ext_reset_in]
connect_bd_net [get_bd_pins sys_rstgen1/peripheral_aresetn] \
  [get_bd_pins axi_dma_0/axi_resetn] [get_bd_pins axi_dma_1/axi_resetn] [get_bd_pins axi_interconnect_0/ARESETN] \
  [get_bd_pins axi_interconnect_0/M00_ARESETN] [get_bd_pins axi_interconnect_0/S00_ARESETN] \
  [get_bd_pins axi_interconnect_0/S01_ARESETN] [get_bd_pins axi_interconnect_0/S02_ARESETN] \
  [get_bd_pins axi_interconnect_1/ARESETN] [get_bd_pins axi_interconnect_1/M00_ARESETN] \
  [get_bd_pins axi_interconnect_1/M01_ARESETN] [get_bd_pins axi_interconnect_1/M02_ARESETN] \
  [get_bd_pins axi_interconnect_1/M03_ARESETN] [get_bd_pins axi_interconnect_1/M04_ARESETN] \
  [get_bd_pins axi_interconnect_1/M05_ARESETN] [get_bd_pins axi_interconnect_1/M06_ARESETN] \
  [get_bd_pins axi_interconnect_1/S00_ARESETN] [get_bd_pins axi_interconnect_2/ARESETN] \
  [get_bd_pins axi_interconnect_2/M00_ARESETN] [get_bd_pins axi_interconnect_2/S00_ARESETN] \
  [get_bd_pins axi_interconnect_2/S01_ARESETN] [get_bd_pins axi_interconnect_2/S02_ARESETN] \
  [get_bd_pins openofdm_tx_0/phy_tx_arestn] [get_bd_pins openofdm_tx_0/s00_axi_aresetn] \
  [get_bd_pins openofdm_rx_0/s00_axi_aresetn] [get_bd_pins rx_intf_0/s00_axi_aresetn] \
  [get_bd_pins rx_intf_0/m00_axis_aresetn] [get_bd_pins xpu_0/s00_axi_aresetn] [get_bd_pins side_ch_0/m00_axis_aresetn] \
  [get_bd_pins side_ch_0/s00_axi_aresetn] [get_bd_pins side_ch_0/s00_axis_aresetn] [get_bd_pins tx_intf_0/s00_axi_aresetn] \
  [get_bd_pins tx_intf_0/s00_axis_aresetn] [get_bd_pins axi_interconnect_1/M07_ARESETN]
connect_bd_net [get_bd_pins tx_intf_0/cts_toself_bb_is_ongoing] [get_bd_pins xpu_0/cts_toself_bb_is_ongoing]
connect_bd_net [get_bd_pins tx_intf_0/cts_toself_rf_is_ongoing] [get_bd_pins xpu_0/cts_toself_rf_is_ongoing]
connect_bd_net [get_bd_pins tx_intf_0/dac_data] [get_bd_pins dac_data]
connect_bd_net [get_bd_pins tx_intf_0/dac_valid] [get_bd_pins dac_valid]
connect_bd_net [get_bd_pins tx_intf_0/data_to_acc] [get_bd_pins openofdm_tx_0/bram_din]
connect_bd_net [get_bd_pins tx_intf_0/dma_ready] [get_bd_pins dma_ready]
connect_bd_net [get_bd_pins tx_intf_0/douta] [get_bd_pins xpu_0/douta]
connect_bd_net [get_bd_pins tx_intf_0/phy_tx_start] [get_bd_pins openofdm_tx_0/phy_tx_start] [get_bd_pins side_ch_0/phy_tx_start]
connect_bd_net [get_bd_pins tx_intf_0/tx_hold] [get_bd_pins openofdm_tx_0/result_iq_hold]
connect_bd_net [get_bd_pins tx_intf_0/tx_iq_fifo_empty] [get_bd_pins xpu_0/tx_iq_fifo_empty]
connect_bd_net [get_bd_pins tx_intf_0/tx_pkt_need_ack] [get_bd_pins xpu_0/tx_pkt_need_ack] [get_bd_pins side_ch_0/tx_pkt_need_ack]
connect_bd_net [get_bd_pins tx_intf_0/tx_pkt_retrans_limit] [get_bd_pins xpu_0/tx_pkt_retrans_limit]
connect_bd_net [get_bd_pins xlslice_0/Dout] [get_bd_pins xpu_0/ddc_i]
connect_bd_net [get_bd_pins xlslice_1/Dout] [get_bd_pins xpu_0/ddc_q]
connect_bd_net [get_bd_pins xpu_0/ack_tx_flag] [get_bd_pins tx_intf_0/ack_tx_flag]
connect_bd_net [get_bd_pins xpu_0/addra] [get_bd_pins tx_intf_0/addra_from_xpu]
connect_bd_net [get_bd_pins xpu_0/band] [get_bd_pins tx_intf_0/band]
connect_bd_net [get_bd_pins xpu_0/block_rx_dma_to_ps] [get_bd_pins rx_intf_0/block_rx_dma_to_ps] [get_bd_pins side_ch_0/block_rx_dma_to_ps]
connect_bd_net [get_bd_pins xpu_0/block_rx_dma_to_ps_valid] \
  [get_bd_pins rx_intf_0/block_rx_dma_to_ps_valid] [get_bd_pins side_ch_0/block_rx_dma_to_ps_valid]
connect_bd_net [get_bd_pins xpu_0/channel] [get_bd_pins tx_intf_0/channel]
connect_bd_net [get_bd_pins xpu_0/dina] [get_bd_pins tx_intf_0/dina_from_xpu]
connect_bd_net [get_bd_pins xpu_0/gpio_status_lock_by_sig_valid] [get_bd_pins rx_intf_0/gpio_status_lock_by_sig_valid]
connect_bd_net [get_bd_pins xpu_0/high_tx_allowed0] [get_bd_pins tx_intf_0/high_tx_allowed0]
connect_bd_net [get_bd_pins xpu_0/high_tx_allowed1] [get_bd_pins tx_intf_0/high_tx_allowed1]
connect_bd_net [get_bd_pins xpu_0/mac_addr] [get_bd_pins tx_intf_0/mac_addr]
connect_bd_net [get_bd_pins xpu_0/mute_adc_out_to_bb] [get_bd_pins rx_intf_0/mute_adc_out_to_bb]
connect_bd_net [get_bd_pins xpu_0/retrans_in_progress] [get_bd_pins tx_intf_0/retrans_in_progress]
connect_bd_net [get_bd_pins xpu_0/rssi_half_db] [get_bd_pins openofdm_rx_0/rssi_half_db] [get_bd_pins side_ch_0/rssi_half_db]
connect_bd_net [get_bd_pins xpu_0/rssi_half_db_lock_by_sig_valid] [get_bd_pins rx_intf_0/rssi_half_db_lock_by_sig_valid]
connect_bd_net [get_bd_pins xpu_0/start_retrans] [get_bd_pins tx_intf_0/start_retrans]
connect_bd_net [get_bd_pins xpu_0/tsf_pulse_1M] [get_bd_pins rx_intf_0/tsf_pulse_1M] [get_bd_pins tx_intf_0/tsf_pulse_1M]
connect_bd_net [get_bd_pins xpu_0/tsf_runtime_val] [get_bd_pins rx_intf_0/tsf_runtime_val] [get_bd_pins side_ch_0/tsf_runtime_val]
connect_bd_net [get_bd_pins xpu_0/tx_bb_is_ongoing] [get_bd_pins tx_intf_0/tx_bb_is_ongoing] [get_bd_pins side_ch_0/tx_bb_is_ongoing]
connect_bd_net [get_bd_pins xpu_0/tx_try_complete] [get_bd_pins tx_intf_0/tx_try_complete]
connect_bd_net [get_bd_pins xpu_0/wea] [get_bd_pins tx_intf_0/wea_from_xpu]
connect_bd_net [get_bd_pins xpu_0/tx_status] [get_bd_pins tx_intf_0/tx_status]
connect_bd_net [get_bd_pins xpu_0/high_tx_allowed2] [get_bd_pins tx_intf_0/high_tx_allowed2]
connect_bd_net [get_bd_pins xpu_0/high_tx_allowed3] [get_bd_pins tx_intf_0/high_tx_allowed3]
connect_bd_net [get_bd_pins blk_mem_gen_0/douta] [get_bd_pins xpu_0/git_rev]
connect_bd_net [get_bd_pins xlconstant_0/dout] [get_bd_pins blk_mem_gen_0/addra]
connect_bd_net [get_bd_pins tx_intf_0/tx_itrpt] [get_bd_pins tx_itrpt]
connect_bd_net [get_bd_pins xpu_0/addr3_valid] [get_bd_pins side_ch_0/addr3_valid]
connect_bd_net [get_bd_pins xpu_0/addr3] [get_bd_pins side_ch_0/addr3]
connect_bd_net [get_bd_pins xpu_0/addr2_valid] [get_bd_pins side_ch_0/addr2_valid]
connect_bd_net [get_bd_pins xpu_0/addr2] [get_bd_pins side_ch_0/addr2]
connect_bd_net [get_bd_pins xpu_0/addr1_valid] [get_bd_pins side_ch_0/addr1_valid]
connect_bd_net [get_bd_pins xpu_0/addr1] [get_bd_pins side_ch_0/addr1]
connect_bd_net [get_bd_pins xpu_0/FC_DI_valid] [get_bd_pins side_ch_0/FC_DI_valid]
connect_bd_net [get_bd_pins xpu_0/FC_DI] [get_bd_pins side_ch_0/FC_DI]
connect_bd_net [get_bd_pins openofdm_rx_0/equalizer_valid] [get_bd_pins side_ch_0/equalizer_valid]
connect_bd_net [get_bd_pins openofdm_rx_0/ofdm_symbol_eq_out_pulse] [get_bd_pins side_ch_0/ofdm_symbol_eq_out_pulse]
connect_bd_net [get_bd_pins openofdm_rx_0/equalizer] [get_bd_pins side_ch_0/equalizer]
connect_bd_net [get_bd_pins openofdm_rx_0/phase_offset_taken] [get_bd_pins side_ch_0/phase_offset_taken]
connect_bd_net [get_bd_pins openofdm_rx_0/csi_valid] [get_bd_pins side_ch_0/csi_valid]
connect_bd_net [get_bd_pins openofdm_rx_0/csi] [get_bd_pins side_ch_0/csi]
connect_bd_net [get_bd_pins openofdm_rx_0/long_preamble_detected] [get_bd_pins side_ch_0/long_preamble_detected]
connect_bd_net [get_bd_pins openofdm_rx_0/short_preamble_detected] [get_bd_pins side_ch_0/short_preamble_detected]
connect_bd_net [get_bd_pins rx_intf_0/sample1] [get_bd_pins side_ch_0/sample1_in]
connect_bd_net [get_bd_pins xpu_0/tx_rf_is_ongoing] [get_bd_pins side_ch_0/tx_rf_is_ongoing]
connect_bd_net [get_bd_pins openofdm_rx_0/ht_sgi] [get_bd_pins rx_intf_0/ht_sgi]
connect_bd_net [get_bd_pins tx_intf_0/bram_addr_to_xpu] [get_bd_pins xpu_0/bram_addr]
connect_bd_net [get_bd_pins tx_intf_0/quit_retrans] [get_bd_pins xpu_0/quit_retrans]
connect_bd_net [get_bd_pins xpu_0/start_tx_ack] [get_bd_pins tx_intf_0/start_tx_ack]

current_bd_instance /
connect_bd_intf_net [get_bd_intf_pins axi_hp1_interconnect/M00_AXI] [get_bd_intf_pins sys_ps7/S_AXI_HP1]
connect_bd_intf_net [get_bd_intf_pins sys_ps7/DMA0_ACK] [get_bd_intf_pins axi_spdif_tx_core/dma_ack]
connect_bd_intf_net [get_bd_intf_ports iic_main] [get_bd_intf_pins axi_iic_main/IIC]
connect_bd_intf_net [get_bd_intf_pins axi_cpu_interconnect/M07_AXI] [get_bd_intf_pins axi_ad9361_adc_dma/s_axi]
connect_bd_intf_net [get_bd_intf_pins openwifi_ip/M00_AXI] [get_bd_intf_pins sys_ps7/S_AXI_ACP]
connect_bd_intf_net [get_bd_intf_ports ddr] [get_bd_intf_pins sys_ps7/DDR]
connect_bd_intf_net [get_bd_intf_ports fixed_io] [get_bd_intf_pins sys_ps7/FIXED_IO]
connect_bd_intf_net [get_bd_intf_pins axi_cpu_interconnect/S00_AXI] [get_bd_intf_pins sys_ps7/M_AXI_GP0]
connect_bd_intf_net [get_bd_intf_pins axi_hp0_interconnect/M00_AXI] [get_bd_intf_pins sys_ps7/S_AXI_HP0]
connect_bd_intf_net [get_bd_intf_pins sys_ps7/M_AXI_GP1] [get_bd_intf_pins openwifi_ip/S00_AXI]
connect_bd_intf_net [get_bd_intf_pins axi_cpu_interconnect/M08_AXI] [get_bd_intf_pins axi_ad9361_dac_dma/s_axi]
connect_bd_intf_net [get_bd_intf_pins axi_cpu_interconnect/M02_AXI] [get_bd_intf_pins axi_hdmi_clkgen/s_axi]
connect_bd_intf_net [get_bd_intf_pins axi_hp1_interconnect/S00_AXI] [get_bd_intf_pins axi_ad9361_adc_dma/m_dest_axi]
connect_bd_intf_net [get_bd_intf_pins axi_cpu_interconnect/M00_AXI] [get_bd_intf_pins axi_iic_main/S_AXI]
connect_bd_intf_net [get_bd_intf_pins axi_hp2_interconnect/S00_AXI] [get_bd_intf_pins axi_ad9361_dac_dma/m_src_axi]
connect_bd_intf_net [get_bd_intf_pins openwifi_ip/M00_AXI1] [get_bd_intf_pins sys_ps7/S_AXI_HP3]
connect_bd_intf_net [get_bd_intf_pins axi_cpu_interconnect/M05_AXI] [get_bd_intf_pins axi_spdif_tx_core/s_axi]
connect_bd_intf_net [get_bd_intf_pins axi_hp2_interconnect/M00_AXI] [get_bd_intf_pins sys_ps7/S_AXI_HP2]
connect_bd_intf_net [get_bd_intf_pins axi_hp0_interconnect/S00_AXI] [get_bd_intf_pins axi_hdmi_dma/m_src_axi]
connect_bd_intf_net [get_bd_intf_pins axi_cpu_interconnect/M03_AXI] [get_bd_intf_pins axi_hdmi_dma/s_axi]
connect_bd_intf_net [get_bd_intf_pins axi_cpu_interconnect/M04_AXI] [get_bd_intf_pins axi_hdmi_core/s_axi]
connect_bd_intf_net [get_bd_intf_pins axi_cpu_interconnect/M06_AXI] [get_bd_intf_pins axi_ad9361/s_axi]
connect_bd_intf_net [get_bd_intf_pins axi_hdmi_dma/m_axis] [get_bd_intf_pins axi_hdmi_core/s_axis]
connect_bd_intf_net [get_bd_intf_pins sys_ps7/DMA0_REQ] [get_bd_intf_pins axi_spdif_tx_core/dma_req]
connect_bd_net -net sys_cpu_clk [get_bd_pins sys_ps7/FCLK_CLK0] \
  [get_bd_pins sys_rstgen/slowest_sync_clk] [get_bd_pins axi_hdmi_core/vdma_clk] [get_bd_pins axi_hdmi_dma/s_axi_aclk] \
  [get_bd_pins axi_hdmi_dma/m_src_axi_aclk] [get_bd_pins axi_hdmi_dma/m_axis_aclk] \
  [get_bd_pins axi_spdif_tx_core/dma_req_aclk] [get_bd_pins sys_ps7/DMA0_ACLK] [get_bd_pins sys_ps7/M_AXI_GP0_ACLK] \
  [get_bd_pins axi_cpu_interconnect/ACLK] [get_bd_pins axi_cpu_interconnect/S00_ACLK] \
  [get_bd_pins axi_cpu_interconnect/M00_ACLK] [get_bd_pins axi_iic_main/s_axi_aclk] \
  [get_bd_pins axi_cpu_interconnect/M01_ACLK] [get_bd_pins axi_cpu_interconnect/M02_ACLK] \
  [get_bd_pins axi_hdmi_clkgen/s_axi_aclk] [get_bd_pins axi_cpu_interconnect/M03_ACLK] \
  [get_bd_pins axi_cpu_interconnect/M04_ACLK] [get_bd_pins axi_hdmi_core/s_axi_aclk] \
  [get_bd_pins axi_cpu_interconnect/M05_ACLK] [get_bd_pins axi_spdif_tx_core/s_axi_aclk] \
  [get_bd_pins axi_hp0_interconnect/aclk] [get_bd_pins sys_ps7/S_AXI_HP0_ACLK] [get_bd_pins util_ad9361_tdd_sync/clk] \
  [get_bd_pins axi_cpu_interconnect/M06_ACLK] [get_bd_pins axi_ad9361/s_axi_aclk] [get_bd_pins axi_cpu_interconnect/M07_ACLK] \
  [get_bd_pins axi_ad9361_adc_dma/s_axi_aclk] [get_bd_pins axi_cpu_interconnect/M08_ACLK] \
  [get_bd_pins axi_ad9361_dac_dma/s_axi_aclk] [get_bd_pins axi_hp1_interconnect/aclk] [get_bd_pins sys_ps7/S_AXI_HP1_ACLK] \
  [get_bd_pins axi_ad9361_adc_dma/m_dest_axi_aclk] [get_bd_pins axi_hp2_interconnect/aclk] \
  [get_bd_pins sys_ps7/S_AXI_HP2_ACLK] [get_bd_pins axi_ad9361_dac_dma/m_src_axi_aclk]
connect_bd_net -net sys_200m_clk [get_bd_pins sys_ps7/FCLK_CLK1] \
  [get_bd_pins axi_hdmi_clkgen/clk] [get_bd_pins sys_audio_clkgen/clk_in1] [get_bd_pins axi_ad9361/delay_clk]
# net sys_cpu_reset has one end: sys_rstgen/peripheral_reset
connect_bd_net -net sys_cpu_resetn [get_bd_pins sys_rstgen/peripheral_aresetn] \
  [get_bd_pins axi_hdmi_dma/s_axi_aresetn] [get_bd_pins axi_hdmi_dma/m_src_axi_aresetn] \
  [get_bd_pins axi_spdif_tx_core/dma_req_rstn] [get_bd_pins sys_audio_clkgen/resetn] \
  [get_bd_pins axi_cpu_interconnect/ARESETN] [get_bd_pins axi_cpu_interconnect/S00_ARESETN] \
  [get_bd_pins axi_cpu_interconnect/M00_ARESETN] [get_bd_pins axi_iic_main/s_axi_aresetn] \
  [get_bd_pins axi_cpu_interconnect/M01_ARESETN] [get_bd_pins axi_cpu_interconnect/M02_ARESETN] \
  [get_bd_pins axi_hdmi_clkgen/s_axi_aresetn] [get_bd_pins axi_cpu_interconnect/M03_ARESETN] \
  [get_bd_pins axi_cpu_interconnect/M04_ARESETN] [get_bd_pins axi_hdmi_core/s_axi_aresetn] \
  [get_bd_pins axi_cpu_interconnect/M05_ARESETN] [get_bd_pins axi_spdif_tx_core/s_axi_aresetn] \
  [get_bd_pins axi_hp0_interconnect/aresetn] [get_bd_pins util_ad9361_tdd_sync/rstn] \
  [get_bd_pins util_ad9361_divclk_reset/ext_reset_in] [get_bd_pins axi_ad9361_adc_dma/m_dest_axi_aresetn] \
  [get_bd_pins axi_ad9361_dac_dma/m_src_axi_aresetn] [get_bd_pins axi_cpu_interconnect/M06_ARESETN] \
  [get_bd_pins axi_ad9361/s_axi_aresetn] [get_bd_pins axi_cpu_interconnect/M07_ARESETN] \
  [get_bd_pins axi_ad9361_adc_dma/s_axi_aresetn] [get_bd_pins axi_cpu_interconnect/M08_ARESETN] \
  [get_bd_pins axi_ad9361_dac_dma/s_axi_aresetn] [get_bd_pins axi_hp1_interconnect/aresetn] \
  [get_bd_pins axi_hp2_interconnect/aresetn]
connect_bd_net [get_bd_pins sys_ps7/FCLK_RESET0_N] [get_bd_pins sys_rstgen/ext_reset_in]
connect_bd_net [get_bd_ports gpio_i] [get_bd_pins sys_ps7/GPIO_I]
connect_bd_net [get_bd_pins sys_ps7/GPIO_O] [get_bd_ports gpio_o]
connect_bd_net [get_bd_pins sys_ps7/GPIO_T] [get_bd_ports gpio_t]
connect_bd_net [get_bd_pins sys_ps7/SPI0_SS2_O] [get_bd_ports spi0_csn_2_o]
connect_bd_net [get_bd_pins sys_ps7/SPI0_SS1_O] [get_bd_ports spi0_csn_1_o]
connect_bd_net [get_bd_pins sys_ps7/SPI0_SS_O] [get_bd_ports spi0_csn_0_o]
connect_bd_net [get_bd_ports spi0_csn_i] [get_bd_pins sys_ps7/SPI0_SS_I]
connect_bd_net [get_bd_ports spi0_clk_i] [get_bd_pins sys_ps7/SPI0_SCLK_I]
connect_bd_net [get_bd_pins sys_ps7/SPI0_SCLK_O] [get_bd_ports spi0_clk_o]
connect_bd_net [get_bd_ports spi0_sdo_i] [get_bd_pins sys_ps7/SPI0_MOSI_I]
connect_bd_net [get_bd_pins sys_ps7/SPI0_MOSI_O] [get_bd_ports spi0_sdo_o]
connect_bd_net [get_bd_ports spi0_sdi_i] [get_bd_pins sys_ps7/SPI0_MISO_I]
connect_bd_net [get_bd_pins sys_ps7/SPI1_SS2_O] [get_bd_ports spi1_csn_2_o]
connect_bd_net [get_bd_pins sys_ps7/SPI1_SS1_O] [get_bd_ports spi1_csn_1_o]
connect_bd_net [get_bd_pins sys_ps7/SPI1_SS_O] [get_bd_ports spi1_csn_0_o]
connect_bd_net [get_bd_ports spi1_csn_i] [get_bd_pins sys_ps7/SPI1_SS_I]
connect_bd_net [get_bd_ports spi1_clk_i] [get_bd_pins sys_ps7/SPI1_SCLK_I]
connect_bd_net [get_bd_pins sys_ps7/SPI1_SCLK_O] [get_bd_ports spi1_clk_o]
connect_bd_net [get_bd_ports spi1_sdo_i] [get_bd_pins sys_ps7/SPI1_MOSI_I]
connect_bd_net [get_bd_pins sys_ps7/SPI1_MOSI_O] [get_bd_ports spi1_sdo_o]
connect_bd_net [get_bd_ports spi1_sdi_i] [get_bd_pins sys_ps7/SPI1_MISO_I]
connect_bd_net [get_bd_pins axi_hdmi_clkgen/clk_0] [get_bd_pins axi_hdmi_core/hdmi_clk]
connect_bd_net [get_bd_pins axi_hdmi_core/hdmi_out_clk] [get_bd_ports hdmi_out_clk]
connect_bd_net [get_bd_pins axi_hdmi_core/hdmi_24_hsync] [get_bd_ports hdmi_hsync]
connect_bd_net [get_bd_pins axi_hdmi_core/hdmi_24_vsync] [get_bd_ports hdmi_vsync]
connect_bd_net [get_bd_pins axi_hdmi_core/hdmi_24_data_e] [get_bd_ports hdmi_data_e]
connect_bd_net [get_bd_pins axi_hdmi_core/hdmi_24_data] [get_bd_ports hdmi_data]
connect_bd_net [get_bd_pins sys_audio_clkgen/clk_out1] [get_bd_pins axi_spdif_tx_core/spdif_data_clk]
connect_bd_net [get_bd_pins axi_spdif_tx_core/spdif_tx_o] [get_bd_ports spdif]
connect_bd_net [get_bd_pins sys_concat_intc/dout] [get_bd_pins sys_ps7/IRQ_F2P]
connect_bd_net [get_bd_pins axi_hdmi_dma/irq] [get_bd_pins sys_concat_intc/In15]
connect_bd_net [get_bd_pins axi_iic_main/iic2intc_irpt] [get_bd_pins sys_concat_intc/In14]
connect_bd_net [get_bd_pins GND_1/dout] \
  [get_bd_pins sys_concat_intc/In11] [get_bd_pins sys_concat_intc/In10] [get_bd_pins sys_concat_intc/In9] \
  [get_bd_pins sys_concat_intc/In8] [get_bd_pins sys_concat_intc/In0]
connect_bd_net [get_bd_pins axi_ad9361/l_clk] \
  [get_bd_pins axi_ad9361/clk] [get_bd_pins util_ad9361_divclk/clk] [get_bd_pins util_ad9361_adc_fifo/din_clk] \
  [get_bd_pins axi_ad9361_dac_fifo/dout_clk]
connect_bd_net [get_bd_ports rx_clk_in_p] [get_bd_pins axi_ad9361/rx_clk_in_p]
connect_bd_net [get_bd_ports rx_clk_in_n] [get_bd_pins axi_ad9361/rx_clk_in_n]
connect_bd_net [get_bd_ports rx_frame_in_p] [get_bd_pins axi_ad9361/rx_frame_in_p]
connect_bd_net [get_bd_ports rx_frame_in_n] [get_bd_pins axi_ad9361/rx_frame_in_n]
connect_bd_net [get_bd_ports rx_data_in_p] [get_bd_pins axi_ad9361/rx_data_in_p]
connect_bd_net [get_bd_ports rx_data_in_n] [get_bd_pins axi_ad9361/rx_data_in_n]
connect_bd_net [get_bd_pins axi_ad9361/tx_clk_out_p] [get_bd_ports tx_clk_out_p]
connect_bd_net [get_bd_pins axi_ad9361/tx_clk_out_n] [get_bd_ports tx_clk_out_n]
connect_bd_net [get_bd_pins axi_ad9361/tx_frame_out_p] [get_bd_ports tx_frame_out_p]
connect_bd_net [get_bd_pins axi_ad9361/tx_frame_out_n] [get_bd_ports tx_frame_out_n]
connect_bd_net [get_bd_pins axi_ad9361/tx_data_out_p] [get_bd_ports tx_data_out_p]
connect_bd_net [get_bd_pins axi_ad9361/tx_data_out_n] [get_bd_ports tx_data_out_n]
connect_bd_net [get_bd_pins axi_ad9361/enable] [get_bd_ports enable]
connect_bd_net [get_bd_pins axi_ad9361/txnrx] [get_bd_ports txnrx]
connect_bd_net [get_bd_ports up_enable] [get_bd_pins axi_ad9361/up_enable]
connect_bd_net [get_bd_ports up_txnrx] [get_bd_pins axi_ad9361/up_txnrx]
connect_bd_net [get_bd_pins util_ad9361_tdd_sync/sync_out] [get_bd_pins axi_ad9361/tdd_sync] [get_bd_ports tdd_sync_o]
connect_bd_net [get_bd_pins axi_ad9361/tdd_sync_cntr] [get_bd_pins util_ad9361_tdd_sync/sync_mode] [get_bd_ports tdd_sync_t]
connect_bd_net [get_bd_ports tdd_sync_i] [get_bd_pins util_ad9361_tdd_sync/sync_in]
connect_bd_net [get_bd_pins axi_ad9361/adc_r1_mode] [get_bd_pins util_ad9361_divclk_sel_concat/In0]
connect_bd_net [get_bd_pins axi_ad9361/dac_r1_mode] [get_bd_pins util_ad9361_divclk_sel_concat/In1]
connect_bd_net [get_bd_pins util_ad9361_divclk_sel_concat/dout] [get_bd_pins util_ad9361_divclk_sel/Op1]
connect_bd_net [get_bd_pins util_ad9361_divclk_sel/Res] [get_bd_pins util_ad9361_divclk/clk_sel]
connect_bd_net [get_bd_pins util_ad9361_divclk/clk_out] \
  [get_bd_pins util_ad9361_divclk_reset/slowest_sync_clk] [get_bd_pins util_ad9361_adc_fifo/dout_clk] \
  [get_bd_pins util_ad9361_adc_pack/clk] [get_bd_pins axi_ad9361_adc_dma/fifo_wr_clk] \
  [get_bd_pins axi_ad9361_dac_fifo/din_clk] [get_bd_pins util_ad9361_dac_upack/clk] \
  [get_bd_pins axi_ad9361_dac_dma/m_axis_aclk] [get_bd_pins openwifi_ip/adc_clk]
connect_bd_net [get_bd_pins axi_ad9361/rst] [get_bd_pins util_ad9361_adc_fifo/din_rst] [get_bd_pins axi_ad9361_dac_fifo/dout_rst]
connect_bd_net [get_bd_pins util_ad9361_divclk_reset/peripheral_aresetn] \
  [get_bd_pins util_ad9361_adc_fifo/dout_rstn] [get_bd_pins axi_ad9361_dac_fifo/din_rstn]
connect_bd_net [get_bd_pins axi_ad9361/adc_enable_i0] [get_bd_pins util_ad9361_adc_fifo/din_enable_0]
connect_bd_net [get_bd_pins axi_ad9361/adc_valid_i0] [get_bd_pins util_ad9361_adc_fifo/din_valid_0]
connect_bd_net [get_bd_pins axi_ad9361/adc_data_i0] [get_bd_pins util_ad9361_adc_fifo/din_data_0]
connect_bd_net [get_bd_pins axi_ad9361/adc_enable_q0] [get_bd_pins util_ad9361_adc_fifo/din_enable_1]
connect_bd_net [get_bd_pins axi_ad9361/adc_valid_q0] [get_bd_pins util_ad9361_adc_fifo/din_valid_1]
connect_bd_net [get_bd_pins axi_ad9361/adc_data_q0] [get_bd_pins util_ad9361_adc_fifo/din_data_1]
connect_bd_net [get_bd_pins axi_ad9361/adc_enable_i1] [get_bd_pins util_ad9361_adc_fifo/din_enable_2]
connect_bd_net [get_bd_pins axi_ad9361/adc_valid_i1] [get_bd_pins util_ad9361_adc_fifo/din_valid_2]
connect_bd_net [get_bd_pins axi_ad9361/adc_data_i1] [get_bd_pins util_ad9361_adc_fifo/din_data_2]
connect_bd_net [get_bd_pins axi_ad9361/adc_enable_q1] [get_bd_pins util_ad9361_adc_fifo/din_enable_3]
connect_bd_net [get_bd_pins axi_ad9361/adc_valid_q1] [get_bd_pins util_ad9361_adc_fifo/din_valid_3]
connect_bd_net [get_bd_pins axi_ad9361/adc_data_q1] [get_bd_pins util_ad9361_adc_fifo/din_data_3]
connect_bd_net [get_bd_pins util_ad9361_adc_fifo/din_ovf] [get_bd_pins axi_ad9361/adc_dovf]
connect_bd_net [get_bd_pins util_ad9361_divclk_reset/peripheral_reset] \
  [get_bd_pins util_ad9361_adc_pack/reset] [get_bd_pins util_ad9361_dac_upack/reset] [get_bd_pins openwifi_ip/adc_rst]
connect_bd_net [get_bd_pins util_ad9361_adc_fifo/dout_valid_0] [get_bd_pins util_ad9361_adc_pack/fifo_wr_en]
connect_bd_net [get_bd_pins util_ad9361_adc_pack/fifo_wr_overflow] [get_bd_pins util_ad9361_adc_fifo/dout_ovf]
connect_bd_net [get_bd_pins util_ad9361_adc_fifo/dout_enable_0] [get_bd_pins util_ad9361_adc_pack/enable_0]
connect_bd_net [get_bd_pins util_ad9361_adc_fifo/dout_data_0] [get_bd_pins util_ad9361_adc_pack/fifo_wr_data_0]
connect_bd_net [get_bd_pins util_ad9361_adc_fifo/dout_enable_1] [get_bd_pins util_ad9361_adc_pack/enable_1]
connect_bd_net [get_bd_pins util_ad9361_adc_fifo/dout_data_1] [get_bd_pins util_ad9361_adc_pack/fifo_wr_data_1]
connect_bd_net [get_bd_pins util_ad9361_adc_fifo/dout_enable_2] [get_bd_pins util_ad9361_adc_pack/enable_2]
connect_bd_net [get_bd_pins util_ad9361_adc_fifo/dout_data_2] [get_bd_pins util_ad9361_adc_pack/fifo_wr_data_2]
connect_bd_net [get_bd_pins util_ad9361_adc_fifo/dout_enable_3] [get_bd_pins util_ad9361_adc_pack/enable_3]
connect_bd_net [get_bd_pins util_ad9361_adc_fifo/dout_data_3] [get_bd_pins util_ad9361_adc_pack/fifo_wr_data_3]
connect_bd_net [get_bd_pins axi_ad9361/dac_enable_i0] [get_bd_pins axi_ad9361_dac_fifo/dout_enable_0]
connect_bd_net [get_bd_pins axi_ad9361/dac_valid_i0] [get_bd_pins axi_ad9361_dac_fifo/dout_valid_0]
connect_bd_net [get_bd_pins axi_ad9361_dac_fifo/dout_data_0] [get_bd_pins axi_ad9361/dac_data_i0]
connect_bd_net [get_bd_pins axi_ad9361/dac_enable_q0] [get_bd_pins axi_ad9361_dac_fifo/dout_enable_1]
connect_bd_net [get_bd_pins axi_ad9361/dac_valid_q0] [get_bd_pins axi_ad9361_dac_fifo/dout_valid_1]
connect_bd_net [get_bd_pins axi_ad9361_dac_fifo/dout_data_1] [get_bd_pins axi_ad9361/dac_data_q0]
connect_bd_net [get_bd_pins axi_ad9361/dac_enable_i1] [get_bd_pins axi_ad9361_dac_fifo/dout_enable_2]
connect_bd_net [get_bd_pins axi_ad9361/dac_valid_i1] [get_bd_pins axi_ad9361_dac_fifo/dout_valid_2]
connect_bd_net [get_bd_pins axi_ad9361_dac_fifo/dout_data_2] [get_bd_pins axi_ad9361/dac_data_i1]
connect_bd_net [get_bd_pins axi_ad9361/dac_enable_q1] [get_bd_pins axi_ad9361_dac_fifo/dout_enable_3]
connect_bd_net [get_bd_pins axi_ad9361/dac_valid_q1] [get_bd_pins axi_ad9361_dac_fifo/dout_valid_3]
connect_bd_net [get_bd_pins axi_ad9361_dac_fifo/dout_data_3] [get_bd_pins axi_ad9361/dac_data_q1]
connect_bd_net [get_bd_pins axi_ad9361_dac_fifo/dout_unf] [get_bd_pins axi_ad9361/dac_dunf]
connect_bd_net [get_bd_pins axi_ad9361_dac_fifo/din_valid_0] [get_bd_pins util_ad9361_dac_upack/fifo_rd_en]
connect_bd_net [get_bd_pins util_ad9361_dac_upack/fifo_rd_underflow] [get_bd_pins axi_ad9361_dac_fifo/din_unf]
connect_bd_net [get_bd_pins axi_ad9361_dac_fifo/din_enable_0] [get_bd_pins util_ad9361_dac_upack/enable_0]
connect_bd_net [get_bd_pins util_ad9361_dac_upack/fifo_rd_valid] \
  [get_bd_pins axi_ad9361_dac_fifo/din_valid_in_0] [get_bd_pins axi_ad9361_dac_fifo/din_valid_in_1] \
  [get_bd_pins axi_ad9361_dac_fifo/din_valid_in_2] [get_bd_pins axi_ad9361_dac_fifo/din_valid_in_3]
connect_bd_net [get_bd_pins util_ad9361_dac_upack/fifo_rd_data_0] [get_bd_pins axi_ad9361_dac_fifo/din_data_0]
connect_bd_net [get_bd_pins axi_ad9361_dac_fifo/din_enable_1] [get_bd_pins util_ad9361_dac_upack/enable_1]
connect_bd_net [get_bd_pins util_ad9361_dac_upack/fifo_rd_data_1] [get_bd_pins axi_ad9361_dac_fifo/din_data_1]
connect_bd_net [get_bd_pins axi_ad9361_dac_fifo/din_enable_2] [get_bd_pins util_ad9361_dac_upack/enable_2]
connect_bd_net [get_bd_pins util_ad9361_dac_upack/fifo_rd_data_2] [get_bd_pins axi_ad9361_dac_fifo/din_data_2]
connect_bd_net [get_bd_pins axi_ad9361_dac_fifo/din_enable_3] [get_bd_pins util_ad9361_dac_upack/enable_3]
connect_bd_net [get_bd_pins util_ad9361_dac_upack/fifo_rd_data_3] [get_bd_pins axi_ad9361_dac_fifo/din_data_3]
connect_bd_net [get_bd_pins axi_ad9361_adc_dma/irq] [get_bd_pins sys_concat_intc/In13]
connect_bd_net [get_bd_pins axi_ad9361_dac_dma/irq] [get_bd_pins sys_concat_intc/In12]
connect_bd_net [get_bd_ports gpio_status] [get_bd_pins openwifi_ip/gpio_status]
connect_bd_net [get_bd_pins sys_ps7/FCLK_CLK2] \
  [get_bd_pins sys_ps7/S_AXI_ACP_ACLK] [get_bd_pins sys_ps7/S_AXI_HP3_ACLK] [get_bd_pins sys_ps7/M_AXI_GP1_ACLK] \
  [get_bd_pins openwifi_ip/m_axi_mm2s_aclk]
connect_bd_net [get_bd_pins sys_ps7/FCLK_RESET2_N] [get_bd_pins openwifi_ip/ext_reset_in]
connect_bd_net [get_bd_pins util_ad9361_adc_pack/packed_fifo_wr_data] [get_bd_pins axi_ad9361_adc_dma/fifo_wr_din] [get_bd_pins openwifi_ip/adc_data]
connect_bd_net [get_bd_pins util_ad9361_adc_pack/packed_fifo_wr_en] [get_bd_pins axi_ad9361_adc_dma/fifo_wr_en] [get_bd_pins openwifi_ip/adc_valid]
connect_bd_net [get_bd_pins axi_ad9361_adc_dma/fifo_wr_overflow] [get_bd_pins util_ad9361_adc_pack/packed_fifo_wr_overflow]
connect_bd_net [get_bd_pins util_ad9361_adc_pack/packed_fifo_wr_sync] [get_bd_pins axi_ad9361_adc_dma/fifo_wr_sync]
connect_bd_net [get_bd_pins openwifi_ip/dac_data] [get_bd_pins util_ad9361_dac_upack/s_axis_data]
connect_bd_net [get_bd_pins openwifi_ip/dac_valid] [get_bd_pins util_ad9361_dac_upack/s_axis_valid]
connect_bd_net [get_bd_pins openwifi_ip/dma_ready] [get_bd_pins axi_ad9361_dac_dma/m_axis_ready]
connect_bd_net -net dac_ready_1 [get_bd_pins util_ad9361_dac_upack/s_axis_ready] [get_bd_pins openwifi_ip/dac_ready]
connect_bd_net -net dma_data_1 [get_bd_pins axi_ad9361_dac_dma/m_axis_data] [get_bd_pins openwifi_ip/dma_data]
connect_bd_net -net dma_valid_1 [get_bd_pins axi_ad9361_dac_dma/m_axis_valid] [get_bd_pins openwifi_ip/dma_valid]
connect_bd_net [get_bd_pins openwifi_ip/mm2s_introut] [get_bd_pins sys_concat_intc/In6]
connect_bd_net [get_bd_pins openwifi_ip/mm2s_introut1] [get_bd_pins sys_concat_intc/In2]
connect_bd_net [get_bd_pins openwifi_ip/rx_pkt_intr] [get_bd_pins sys_concat_intc/In1]
connect_bd_net [get_bd_pins openwifi_ip/s2mm_introut] [get_bd_pins sys_concat_intc/In3]
connect_bd_net [get_bd_pins openwifi_ip/s2mm_introut1] [get_bd_pins sys_concat_intc/In7]
connect_bd_net [get_bd_pins openwifi_ip/tx_itrpt] [get_bd_pins sys_concat_intc/In5]
